# EAGLE design Video_1.0 (EAGLE 9.7.0)

## Sheet 1 of 2: BUS
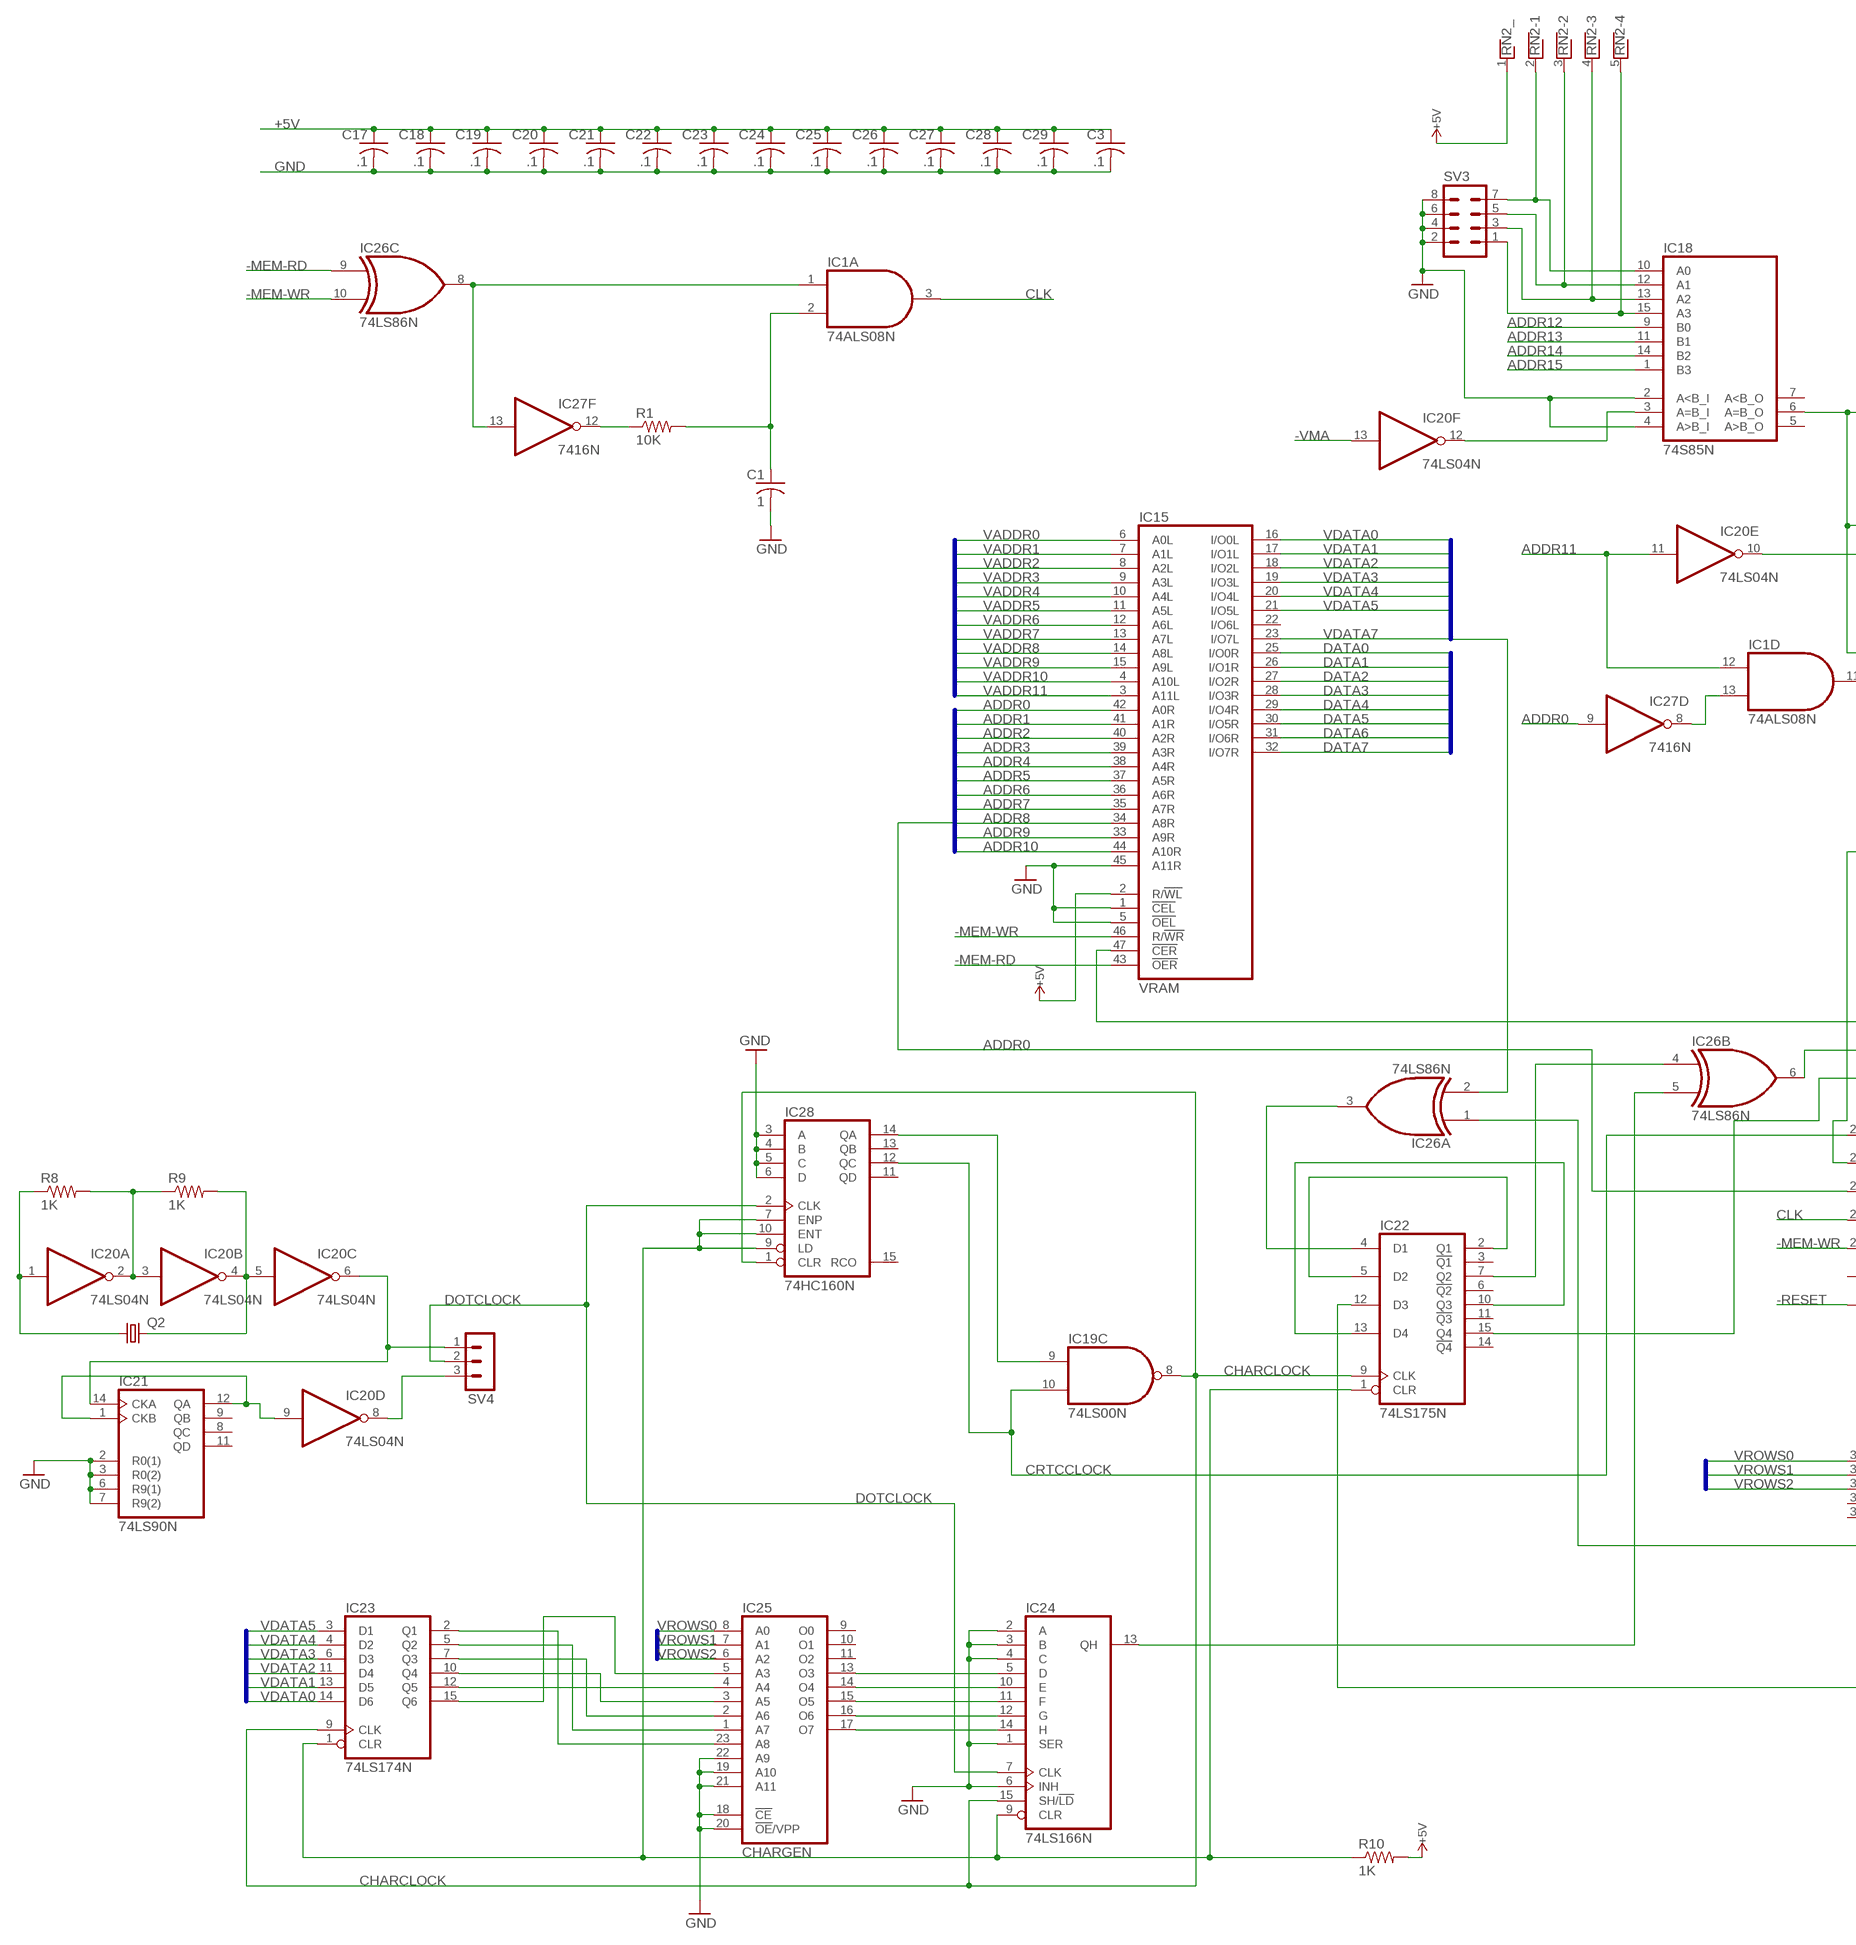
[diagram p0: schematic, sheet 1, part 1 of 2]
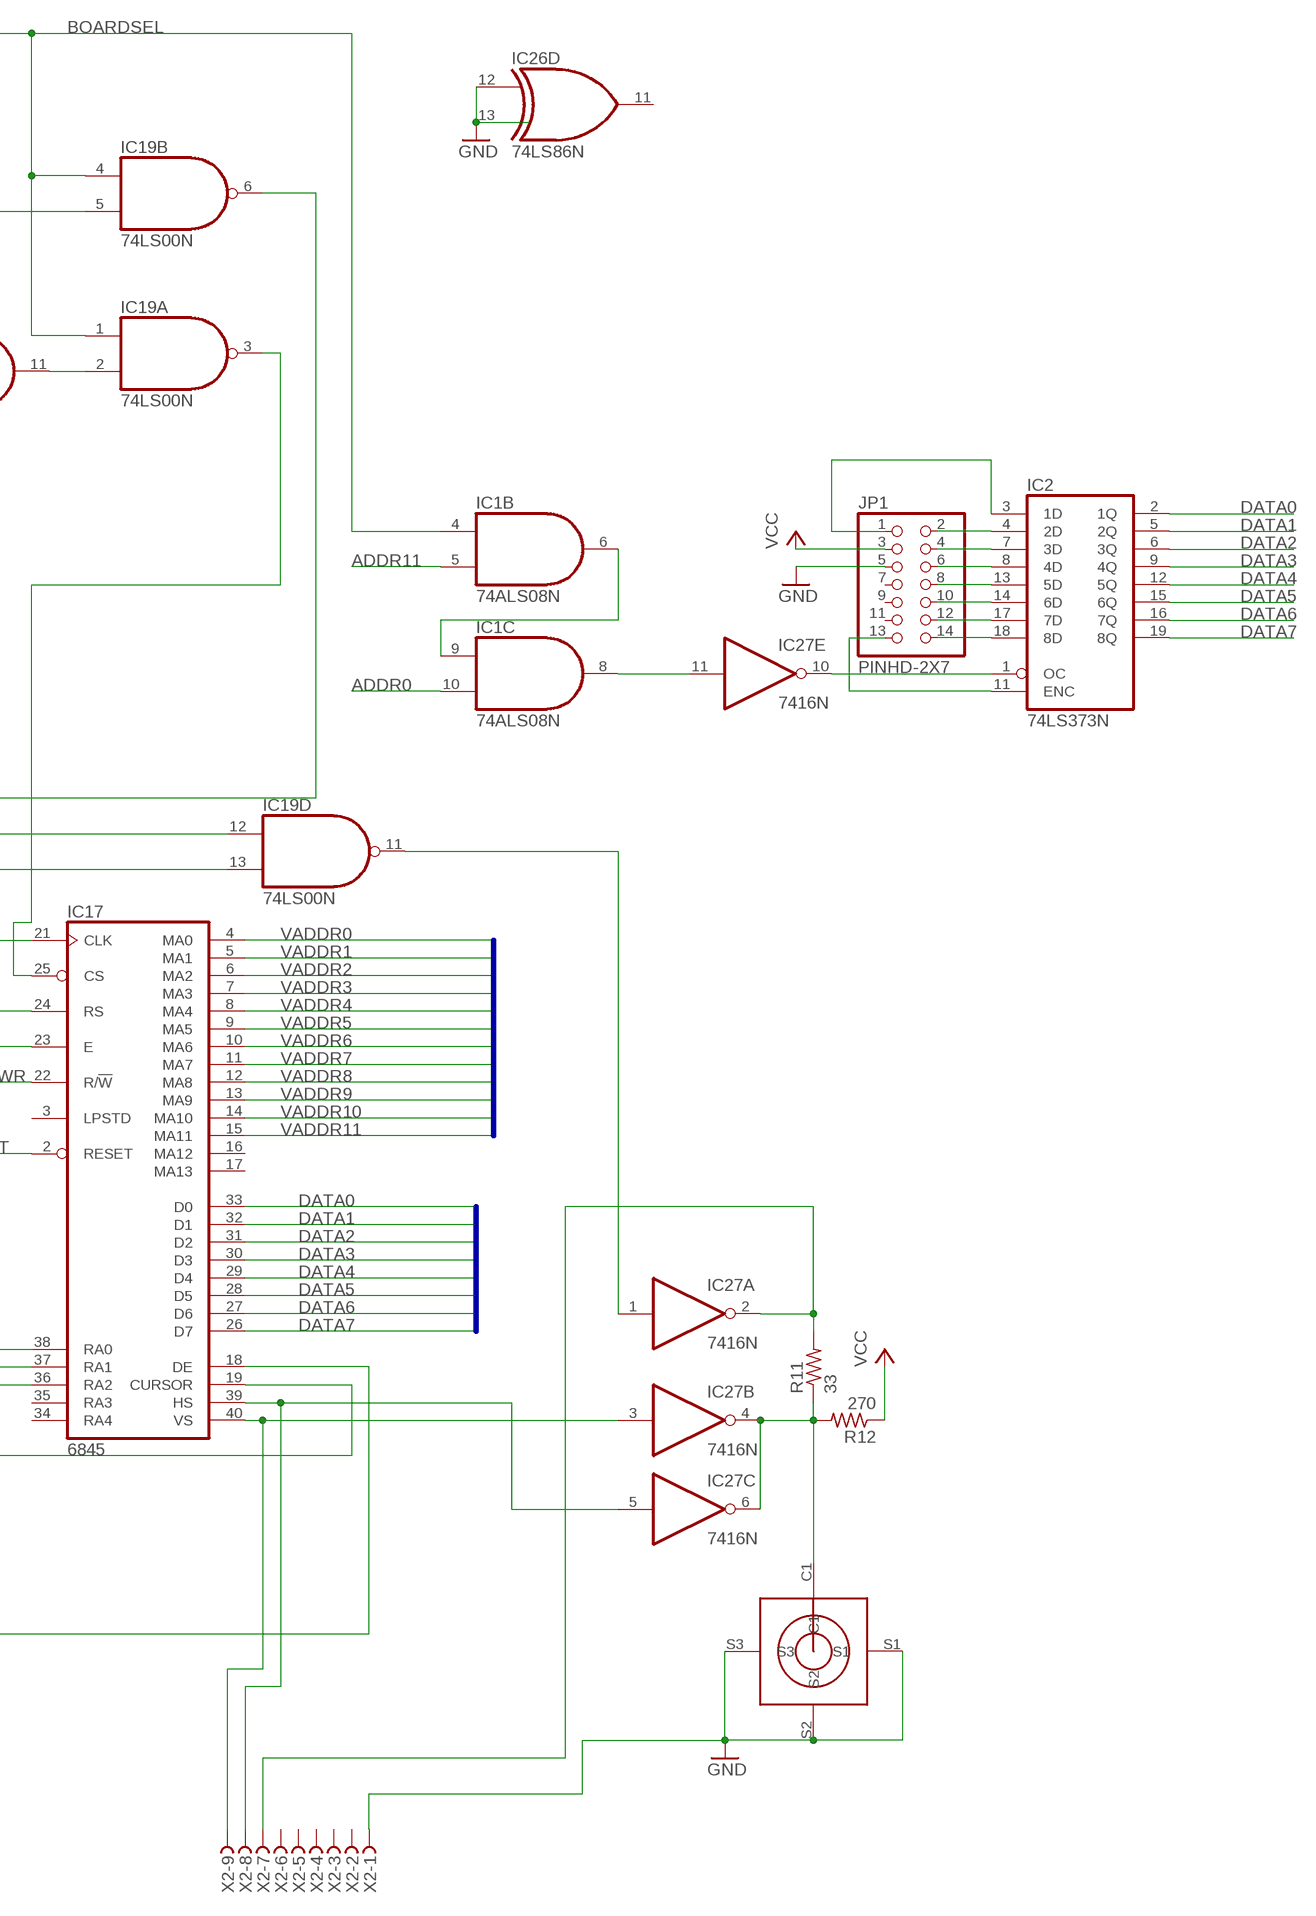
[diagram p1: schematic, sheet 1, part 2 of 2]

### Parts
C1  1  C-US025-050X050  [C025-050X050]
C3  .1  C-US025-050X050  [C025-050X050]
C17  .1  C-US025-050X050  [C025-050X050]
C18  .1  C-US025-050X050  [C025-050X050]
C19  .1  C-US025-050X050  [C025-050X050]
C20  .1  C-US025-050X050  [C025-050X050]
C21  .1  C-US025-050X050  [C025-050X050]
C22  .1  C-US025-050X050  [C025-050X050]
C23  .1  C-US025-050X050  [C025-050X050]
C24  .1  C-US025-050X050  [C025-050X050]
C25  .1  C-US025-050X050  [C025-050X050]
C26  .1  C-US025-050X050  [C025-050X050]
C27  .1  C-US025-050X050  [C025-050X050]
C28  .1  C-US025-050X050  [C025-050X050]
C29  .1  C-US025-050X050  [C025-050X050]
IC1  74ALS08N  [DIL14]
IC2  74LS373N  [DIL20]
IC15  VRAM  7134P  [DIL48]
IC17  6845  [DIL40]
IC18  74S85N  [DIL16]
IC19  74LS00N  [DIL14]
IC20  74LS04N  [DIL14]
IC21  74LS90N  [DIL14]
IC22  74LS175N  [DIL16]
IC23  74LS174N  [DIL16]
IC24  74LS166N  [DIL16]
IC25  CHARGEN  2732  [DIL24]
IC26  74LS86N  [DIL14]
IC27  7416N  [DIL14]
IC28  74HC160N  [DIL16]
JP1  PINHD-2X7  [2X07]
Q2  CRYTALHC49U-V  [HC49U-V]
R1  10K  R-US_0207/7  [0207/7]
R8  1K  R-US_0207/7  [0207/7]
R9  1K  R-US_0207/7  [0207/7]
R10  1K  R-US_0207/7  [0207/7]
R11  33  R-US_0207/7  [0207/7]
R12  270  R-US_0207/7  [0207/7]
RN2  RNX4  [RN-5]
SV3  MA04-2  [MA04-2]
SV4  MA03-1  [MA03-1]
U$3  RCA  [RCA]
X2  F09HPS  [F09HP]

### Nets
+5V [GND]: C3.1 C17.1 C18.1 C19.1 C20.1 C21.1 C22.1 C23.1 C24.1 C25.1 C26.1 C27.1 C28.1 C29.1 IC15.2(R/!WL) R10.2 R12.1 RN2.1 ; supply symbol labelled VCC ; also sheet 2
-MEM-RD: IC15.43(!OER) IC26.9(C:I0) ; also sheet 2
-MEM-WR: IC15.46(R/!WR) IC17.22(R/!W) IC26.10(C:I1) ; also sheet 2
-RESET: IC17.2(RESET) ; also sheet 2
-VMA: IC20.13(F:I) ; also sheet 2
ADDR0: IC1.10(C:I1) IC15.42(A0R) IC17.24(RS) IC27.9(D:I) ; also sheet 2
ADDR1: IC15.41(A1R) ; also sheet 2
ADDR2: IC15.40(A2R) ; also sheet 2
ADDR3: IC15.39(A3R) ; also sheet 2
ADDR4: IC15.38(A4R) ; also sheet 2
ADDR5: IC15.37(A5R) ; also sheet 2
ADDR6: IC15.36(A6R) ; also sheet 2
ADDR7: IC15.35(A7R) ; also sheet 2
ADDR8: IC15.34(A8R) ; also sheet 2
ADDR9: IC15.33(A9R) ; also sheet 2
ADDR10: IC15.44(A10R) ; also sheet 2
ADDR11: IC1.5(B:I1) IC1.12(D:I0) IC20.11(E:I) ; also sheet 2
ADDR12: IC18.9(B0) ; also sheet 2
ADDR13: IC18.11(B1) ; also sheet 2
ADDR14: IC18.14(B2) ; also sheet 2
ADDR15: IC18.1(B3) ; also sheet 2
BOARDSEL: IC1.4(B:I0) IC18.6(A=B_O) IC19.1(A:I0) IC19.4(B:I0)
CHARCLOCK: IC19.8(C:O) IC22.9(CLK) IC23.9(CLK) IC24.15(SH/!LD) IC28.1(CLR)
CLK: IC1.3(A:O) IC17.23(E)
CRTCCLOCK: IC17.21(CLK) IC19.10(C:I1) IC28.12(QC)
DATA0: IC2.2(1Q) IC15.25(I/O0R) IC17.33(D0) ; also sheet 2
DATA1: IC2.5(2Q) IC15.26(I/O1R) IC17.32(D1) ; also sheet 2
DATA2: IC2.6(3Q) IC15.27(I/O2R) IC17.31(D2) ; also sheet 2
DATA3: IC2.9(4Q) IC15.28(I/O3R) IC17.30(D3) ; also sheet 2
DATA4: IC2.12(5Q) IC15.29(I/O4R) IC17.29(D4) ; also sheet 2
DATA5: IC2.15(6Q) IC15.30(I/O5R) IC17.28(D5) ; also sheet 2
DATA6: IC2.16(7Q) IC15.31(I/O6R) IC17.27(D6) ; also sheet 2
DATA7: IC2.19(8Q) IC15.32(I/O7R) IC17.26(D7) ; also sheet 2
DOTCLOCK: IC24.7(CLK) IC28.2(CLK) SV4.2
GND: C1.2 C3.2 C17.2 C18.2 C19.2 C20.2 C21.2 C22.2 C23.2 C24.2 C25.2 C26.2 C27.2 C28.2 C29.2 IC15.1(!CEL) IC15.5(!OEL) IC15.45(A11R) IC18.2(A<B_I) IC18.4(A>B_I) IC21.2(R0(1)) IC21.3(R0(2)) IC21.6(R9(1)) IC21.7(R9(2)) IC24.1(SER) IC24.2(A) IC24.3(B) IC24.4(C) IC24.6(INH) IC25.18(!CE) IC25.19(A10) IC25.20(!OE!/VPP) IC25.21(A11) IC25.22(A9) IC26.12(D:I0) IC26.13(D:I1) IC28.3(A) IC28.4(B) IC28.5(C) IC28.6(D) JP1.5 SV3.2 SV3.4 SV3.6 SV3.8 U$3.S1 U$3.S2 U$3.S3 X2.1 ; also sheet 2
N$1: IC1.1(A:I0) IC26.8(C:O) IC27.13(F:I)
N$2: IC1.11(D:O) IC19.2(A:I1)
N$3: IC27.12(F:O) R1.1
N$4: C1.1 IC1.2(A:I1) R1.2
N$5: IC1.13(D:I1) IC27.8(D:O)
N$6: IC1.8(C:O) IC27.11(E:I)
N$7: IC2.18(8D) JP1.14
N$8: IC2.17(7D) JP1.12
N$9: IC2.14(6D) JP1.10
N$10: IC2.13(5D) JP1.8
N$12: IC2.8(4D) JP1.6
N$13: IC2.7(3D) JP1.4
N$14: IC2.4(2D) JP1.2
N$15: IC2.3(1D) JP1.1
N$16: IC2.1(OC) IC27.10(E:O)
N$17: IC1.6(B:O) IC1.9(C:I0)
N$18: IC2.11(ENC) JP1.13
N$48: IC18.10(A0) RN2.2 SV3.7
N$49: IC18.12(A1) RN2.3 SV3.5
N$50: IC18.13(A2) RN2.4 SV3.3
N$51: IC18.15(A3) RN2.5 SV3.1
N$52: IC15.47(!CER) IC19.6(B:O)
N$54: IC20.1(A:I) Q2.1 R8.1
N$55: IC20.4(B:O) IC20.5(C:I) Q2.2 R9.2
N$56: IC20.2(A:O) IC20.3(B:I) R8.2 R9.1
N$57: IC20.6(C:O) IC21.14(CKA) SV4.1
N$58: IC20.9(D:I) IC21.1(CKB) IC21.12(QA)
N$59: IC20.8(D:O) SV4.3
N$60: IC19.9(C:I0) IC28.14(QA)
N$61: IC22.2(Q1) IC22.5(D2)
N$62: IC24.5(D) IC25.13(O3)
N$63: IC24.10(E) IC25.14(O4)
N$64: IC24.11(F) IC25.15(O5)
N$65: IC24.12(G) IC25.16(O6)
N$66: IC24.14(H) IC25.17(O7)
N$67: IC23.2(Q1) IC25.23(A8)
N$68: IC23.5(Q2) IC25.1(A7)
N$69: IC23.7(Q3) IC25.2(A6)
N$70: IC23.10(Q4) IC25.3(A5)
N$71: IC23.12(Q5) IC25.4(A4)
N$72: IC23.15(Q6) IC25.5(A3)
N$73: IC22.1(CLR) IC23.1(CLR) IC24.9(CLR) IC28.7(ENP) IC28.9(LD) IC28.10(ENT) R10.1
N$74: IC17.19(CURSOR) IC26.1(A:I0)
N$75: IC22.4(D1) IC26.3(A:O)
N$76: IC22.7(Q2) IC26.4(B:I0)
N$77: IC24.13(QH) IC26.5(B:I1)
N$78: IC22.10(Q3) IC22.13(D4)
N$79: IC17.18(DE) IC22.12(D3)
N$80: IC19.12(D:I0) IC26.6(B:O)
N$81: IC19.13(D:I1) IC22.15(Q4)
N$82: IC17.40(VS) IC27.3(B:I) X2.9
N$83: IC17.39(HS) IC27.5(C:I) X2.8
N$84: IC19.11(D:O) IC27.1(A:I)
N$85: IC27.4(B:O) IC27.6(C:O) R11.1 R12.2 U$3.C1
N$86: IC27.2(A:O) R11.2 X2.7
N$87: IC19.5(B:I1) IC20.10(E:O)
N$89: IC18.3(A=B_I) IC20.12(F:O)
N$91: IC17.25(CS) IC19.3(A:O)
VADDR0: IC15.6(A0L) IC17.4(MA0)
VADDR1: IC15.7(A1L) IC17.5(MA1)
VADDR2: IC15.8(A2L) IC17.6(MA2)
VADDR3: IC15.9(A3L) IC17.7(MA3)
VADDR4: IC15.10(A4L) IC17.8(MA4)
VADDR5: IC15.11(A5L) IC17.9(MA5)
VADDR6: IC15.12(A6L) IC17.10(MA6)
VADDR7: IC15.13(A7L) IC17.11(MA7)
VADDR8: IC15.14(A8L) IC17.12(MA8)
VADDR9: IC15.15(A9L) IC17.13(MA9)
VADDR10: IC15.4(A10L) IC17.14(MA10)
VADDR11: IC15.3(A11L) IC17.15(MA11)
VCC: JP1.3 ; also sheet 2
VDATA0: IC15.16(I/O0L) IC23.14(D6)
VDATA1: IC15.17(I/O1L) IC23.13(D5)
VDATA2: IC15.18(I/O2L) IC23.11(D4)
VDATA3: IC15.19(I/O3L) IC23.6(D3)
VDATA4: IC15.20(I/O4L) IC23.4(D2)
VDATA5: IC15.21(I/O5L) IC23.3(D1)
VDATA7: IC15.23(I/O7L) IC26.2(A:I1)
VROWS0: IC17.38(RA0) IC25.8(A0)
VROWS1: IC17.37(RA1) IC25.7(A1)
VROWS2: IC17.36(RA2) IC25.6(A2)
Unconnected: IC15.22(I/O6L) IC17.3(LPSTD) IC17.16(MA12) IC17.17(MA13) IC17.34(RA4) IC17.35(RA3) IC18.5(A>B_O) IC18.7(A<B_O) IC21.8(QC) IC21.9(QB) IC21.11(QD) IC22.3(!Q1) IC22.6(!Q2) IC22.11(!Q3) IC22.14(!Q4) IC25.9(O0) IC25.10(O1) IC25.11(O2) IC26.11(D:O) IC28.11(QD) IC28.13(QB) IC28.15(RCO) JP1.7 JP1.9 JP1.11 X2.2 X2.3 X2.4 X2.5 X2.6

### Buses
VADDR[0..11]
VDATA[0..7]
CPUDATA[0..7],D0,D1,D2,D3,D4,D5,D6,D7,DATA0,DATA1,DATA2,DATA3,DATA4,DATA5,DATA6,DATA7
A0,A1,A2,A3,A4,A5,A6,A7,ADDR[0..15]
VROWS[0..4]

## Sheet 2 of 2
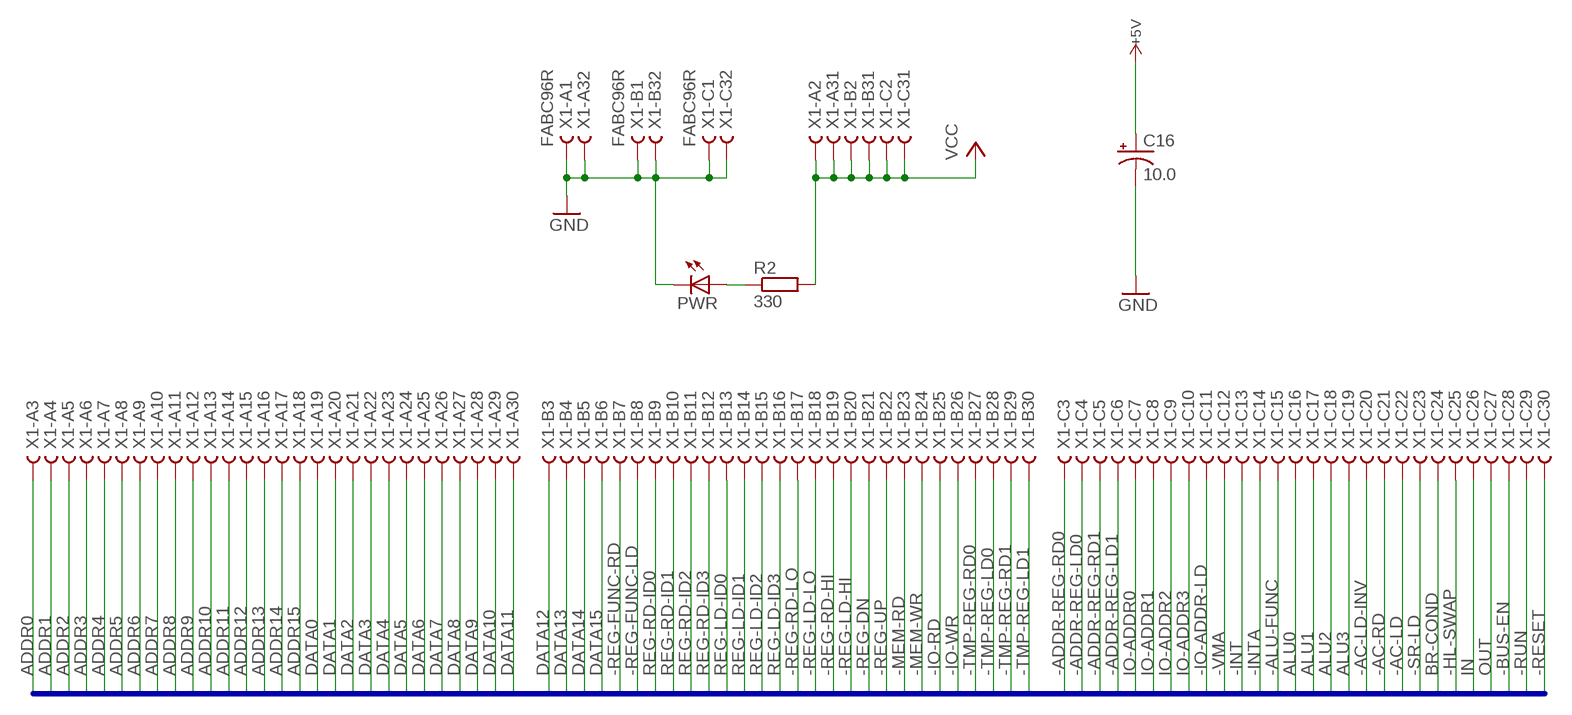
[diagram p2: schematic, sheet 2]

### Parts
C16  10.0  CPOL-USE2.5-7  [E2,5-7]
PWR  LED5MM  [LED5MM]
R2  330  R0207/10  [0207/10]
X1  FABC96R  [FABC96R]

### Nets
+5V [GND]: C16.+ ; also sheet 1
-AC-LD: X1.C22
-AC-LD-INV: X1.C20
-AC-RD: X1.C21
-ADDR-REG-LD0: X1.C4
-ADDR-REG-LD1: X1.C6
-ADDR-REG-RD0: X1.C3
-ADDR-REG-RD1: X1.C5
-ALU-FUNC: X1.C15
-BUS-EN: X1.C28
-HL-SWAP: X1.C25
-INT: X1.C13
-INTA: X1.C14
-IO-ADDR-LD: X1.C11
-IO-RD: X1.B25
-IO-WR: X1.B26
-MEM-RD: X1.B23 ; also sheet 1
-MEM-WR: X1.B24 ; also sheet 1
-REG-DN: X1.B21
-REG-FUNC-LD: X1.B8
-REG-FUNC-RD: X1.B7
-REG-LD-HI: X1.B20
-REG-LD-LO: X1.B18
-REG-RD-HI: X1.B19
-REG-RD-LO: X1.B17
-REG-UP: X1.B22
-RESET: X1.C30 ; also sheet 1
-RUN: X1.C29
-SR-LD: X1.C23
-TMP-REG-LD0: X1.B28
-TMP-REG-LD1: X1.B30
-TMP-REG-RD0: X1.B27
-TMP-REG-RD1: X1.B29
-VMA: X1.C12 ; also sheet 1
ADDR0: X1.A3 ; also sheet 1
ADDR1: X1.A4 ; also sheet 1
ADDR2: X1.A5 ; also sheet 1
ADDR3: X1.A6 ; also sheet 1
ADDR4: X1.A7 ; also sheet 1
ADDR5: X1.A8 ; also sheet 1
ADDR6: X1.A9 ; also sheet 1
ADDR7: X1.A10 ; also sheet 1
ADDR8: X1.A11 ; also sheet 1
ADDR9: X1.A12 ; also sheet 1
ADDR10: X1.A13 ; also sheet 1
ADDR11: X1.A14 ; also sheet 1
ADDR12: X1.A15 ; also sheet 1
ADDR13: X1.A16 ; also sheet 1
ADDR14: X1.A17 ; also sheet 1
ADDR15: X1.A18 ; also sheet 1
ALU0: X1.C16
ALU1: X1.C17
ALU2: X1.C18
ALU3: X1.C19
BR-COND: X1.C24
DATA0: X1.A19 ; also sheet 1
DATA1: X1.A20 ; also sheet 1
DATA2: X1.A21 ; also sheet 1
DATA3: X1.A22 ; also sheet 1
DATA4: X1.A23 ; also sheet 1
DATA5: X1.A24 ; also sheet 1
DATA6: X1.A25 ; also sheet 1
DATA7: X1.A26 ; also sheet 1
DATA8: X1.A27
DATA9: X1.A28
DATA10: X1.A29
DATA11: X1.A30
DATA12: X1.B3
DATA13: X1.B4
DATA14: X1.B5
DATA15: X1.B6
GND: C16.- PWR.K(C) X1.A1 X1.A32 X1.B1 X1.B32 X1.C1 X1.C32 ; also sheet 1
IN: X1.C26
IO-ADDR0: X1.C7
IO-ADDR1: X1.C8
IO-ADDR2: X1.C9
IO-ADDR3: X1.C10
N$11: PWR.A R2.1
OUT: X1.C27
REG-LD-ID0: X1.B13
REG-LD-ID1: X1.B14
REG-LD-ID2: X1.B15
REG-LD-ID3: X1.B16
REG-RD-ID0: X1.B9
REG-RD-ID1: X1.B10
REG-RD-ID2: X1.B11
REG-RD-ID3: X1.B12
VCC: R2.2 X1.A2 X1.A31 X1.B2 X1.B31 X1.C2 X1.C31 ; also sheet 1

### Buses
-AC-LD,-AC-LD-INV,-AC-RD,ADDR[0..15],-ADDR-REG-LD[0..1],-ADDR-REG-RD[0..1],ALU[0..3],-ALU-FUNC,BR-COND,-BUS-EN,DATA[0..15],-HL-SWAP,IN,-INT,-INTA,IO-ADDR[0..3],-IO-ADDR-LD,-IO-RD,-IO-WR,-MEM-RD,-MEM-WR,OUT,-REG-DN,-REG-FUNC-LD,-REG-FUNC-RD,-REG-LD-HI,REG-LD-ID[0..3],-REG-LD-LO,-REG-RD-HI,REG-RD-ID[0..3],-REG-RD-LO,-REG-UP,-RESET,-RUN,-SR-LD,-TMP-REG-LD[0..1],-TMP-REG-RD[0..1],-VMA

## Power pins joined to a net without a drawn wire
+5V: IC1.14(P:VCC) IC2.20(VCC)
GND: IC1.7(P:GND) IC2.10(GND) IC15.24(GND) IC17.1(GND) IC18.8(GND) IC19.7(P:GND) IC20.7(P:GND) IC21.10(GND) IC22.8(GND) IC23.8(GND) IC24.8(GND) IC25.12(GND) IC26.7(P:GND) IC27.7(P:GND) IC28.8(GND)
VCC: IC15.48(VCC) IC17.20(VCC) IC18.16(VCC) IC19.14(P:VCC) IC20.14(P:VCC) IC21.5(VCC) IC22.16(VCC) IC23.16(VCC) IC24.16(VCC) IC25.24(VCC) IC26.14(P:VCC) IC27.14(P:VCC) IC28.16(VCC)

## Library data of the parts
C1 C3 C17-C29 = rcl:C-US: CAPACITOR, American symbol
C16 = rcl:CPOL-US: POLARIZED CAPACITOR, American symbol
IC1 = 74xx-us:74*08: Quad 2-input AND gate
IC2 = 74xx-us:74*373: Octal D type transparent LATCH, edge triggered
IC15 = memory-idt:7134P: MEMORY
IC17 = micro-motorola:6845: MICROCONTROLLER/MEMORY DEVICE
IC18 = 74xx-us:74*85: 4-bit magnitude COMPARATOR
IC19 = 74xx-us:74*00: Quad 2-input NAND gate
IC20 = 74xx-us:74*04: Hex INVERTER
IC21 = 74xx-us:74*90: Decade, divide by twelve and binary COUNTER
IC22 = 74xx-us:74*175: Qadruple D type FLIP FLOP, clear
IC23 = 74xx-us:74*174: Hex D type FLIP FLOP, clear
IC24 = 74xx-us:74*166: 8-bit parallel load SHIFT REGISTER
IC25 = memory:2732: MEMORY
IC26 = 74xx-us:74*86: Quad 2-input EXCLUSIV-OR (XOR) gate
IC27 = 74xx-us:74*16: Hex INVERTER, open collector, high-voltage
IC28 = 74xx-eu:74*160: Synchronous 4-bit COUNTER
JP1 = Connector:PINHD-2X7: PIN HEADER; CATEGORY: Headers; DESCRIPTION: Header, Straight, 2x7 Position; MANUFACTURER: Generic; MPN: Generic; OPERATING_TEMPERATURE: Generic; PART_STATUS: Active; PITCH: 0.100" (2.54mm); ROHS_COMPLIANCE: Generic; SERIES: Generic; SUB-CATEGORY: Headers, Male Pins; TYPE: Board to Board or Cable, Unshrouded, Through Hole, Straight
PWR = led:LED: LED OSRAM: - CHIPLED LG R971, LG N971, LY N971, LG Q971, LY Q971, LO R971, LY R971 LH N974, LH R974 LS Q976, LO Q976, LY Q976 LO Q996 - Hyper CHIPLED LW Q18S LB Q993, LB Q99A, LB R99A - SideLED LS A670, LO A670, LY A670, LG A670, LP A670 LB A673, LV A673, LT A673, LW A673 LH A674 LY A675 LS A676, LA A676, LO A676, LY A676, LW A676 LS A679, LY A679, LG A679 - Hyper Micro SIDELED® LS Y876, LA Y876, LO Y876, LY Y876 LT Y87S - SmartLED LW L88C, LW L88S LB L89C, LB L89S, LG L890 LS L89K, LO L89K, LY L89K LS L896, LA L896, LO L896, LY L896 - TOPLED LS T670, LO T670, LY T670, LG T670, LP T670 LSG T670, LSP T670, LSY T670, LOP T670, LYG T670 LG T671, LOG T671, LSG T671 LB T673, LV T673, LT T673, LW T673 LH T674 LS T676, LA T676, LO T676, LY T676, LB T676, LH T676, LSB T676, LW T676 LB T67C, LV T67C, LT T67C, LS T67K, LO T67K, LY T67K, LW E67C LS E67B, LA E67B, LO E67B, LY E67B, LB E67C, LV E67C, LT E67C LW T67C LS T679, LY T679, LG T679 LS T770, LO T770, LY T770, LG T770, LP T770 LB T773, LV T773, LT T773, LW T773 LH T774 LS E675, LA E675, LY E675, LS T675 LS T776, LA T776, LO T776, LY T776, LB T776 LHGB T686 LT T68C, LB T68C - Hyper Mini TOPLED® LB M676 - Mini TOPLED Santana® LG M470 LS M47K, LO M47K, LY M47K Source: http://www.osram.convergy.de/
Q2 = crystal:CRYTAL: CRYSTAL
R1 R8-R12 = rcl:R-US_: RESISTOR, American symbol
R2 = eagle-ltspice:R: RESISTOR, European symbol; SPICEMODEL: NONE; SPICEPREFIX: R
RN2 = resistor-net:RNX4: RESISTOR NETWORK
SV3 = con-lstb:MA04-2: PIN HEADER
SV4 = con-lstb:MA03-1: PIN HEADER
U$3 = cdp:RCA
X1 = con-vg:FABC96R: CONNECTOR female, 96 pins, type R, rows ABC, grid 2.54 mm
X2 = con-subd:F09?S: SUB-D

## Net classes
1 GND: width 1 mm
2 5V: width 1 mm

## Board
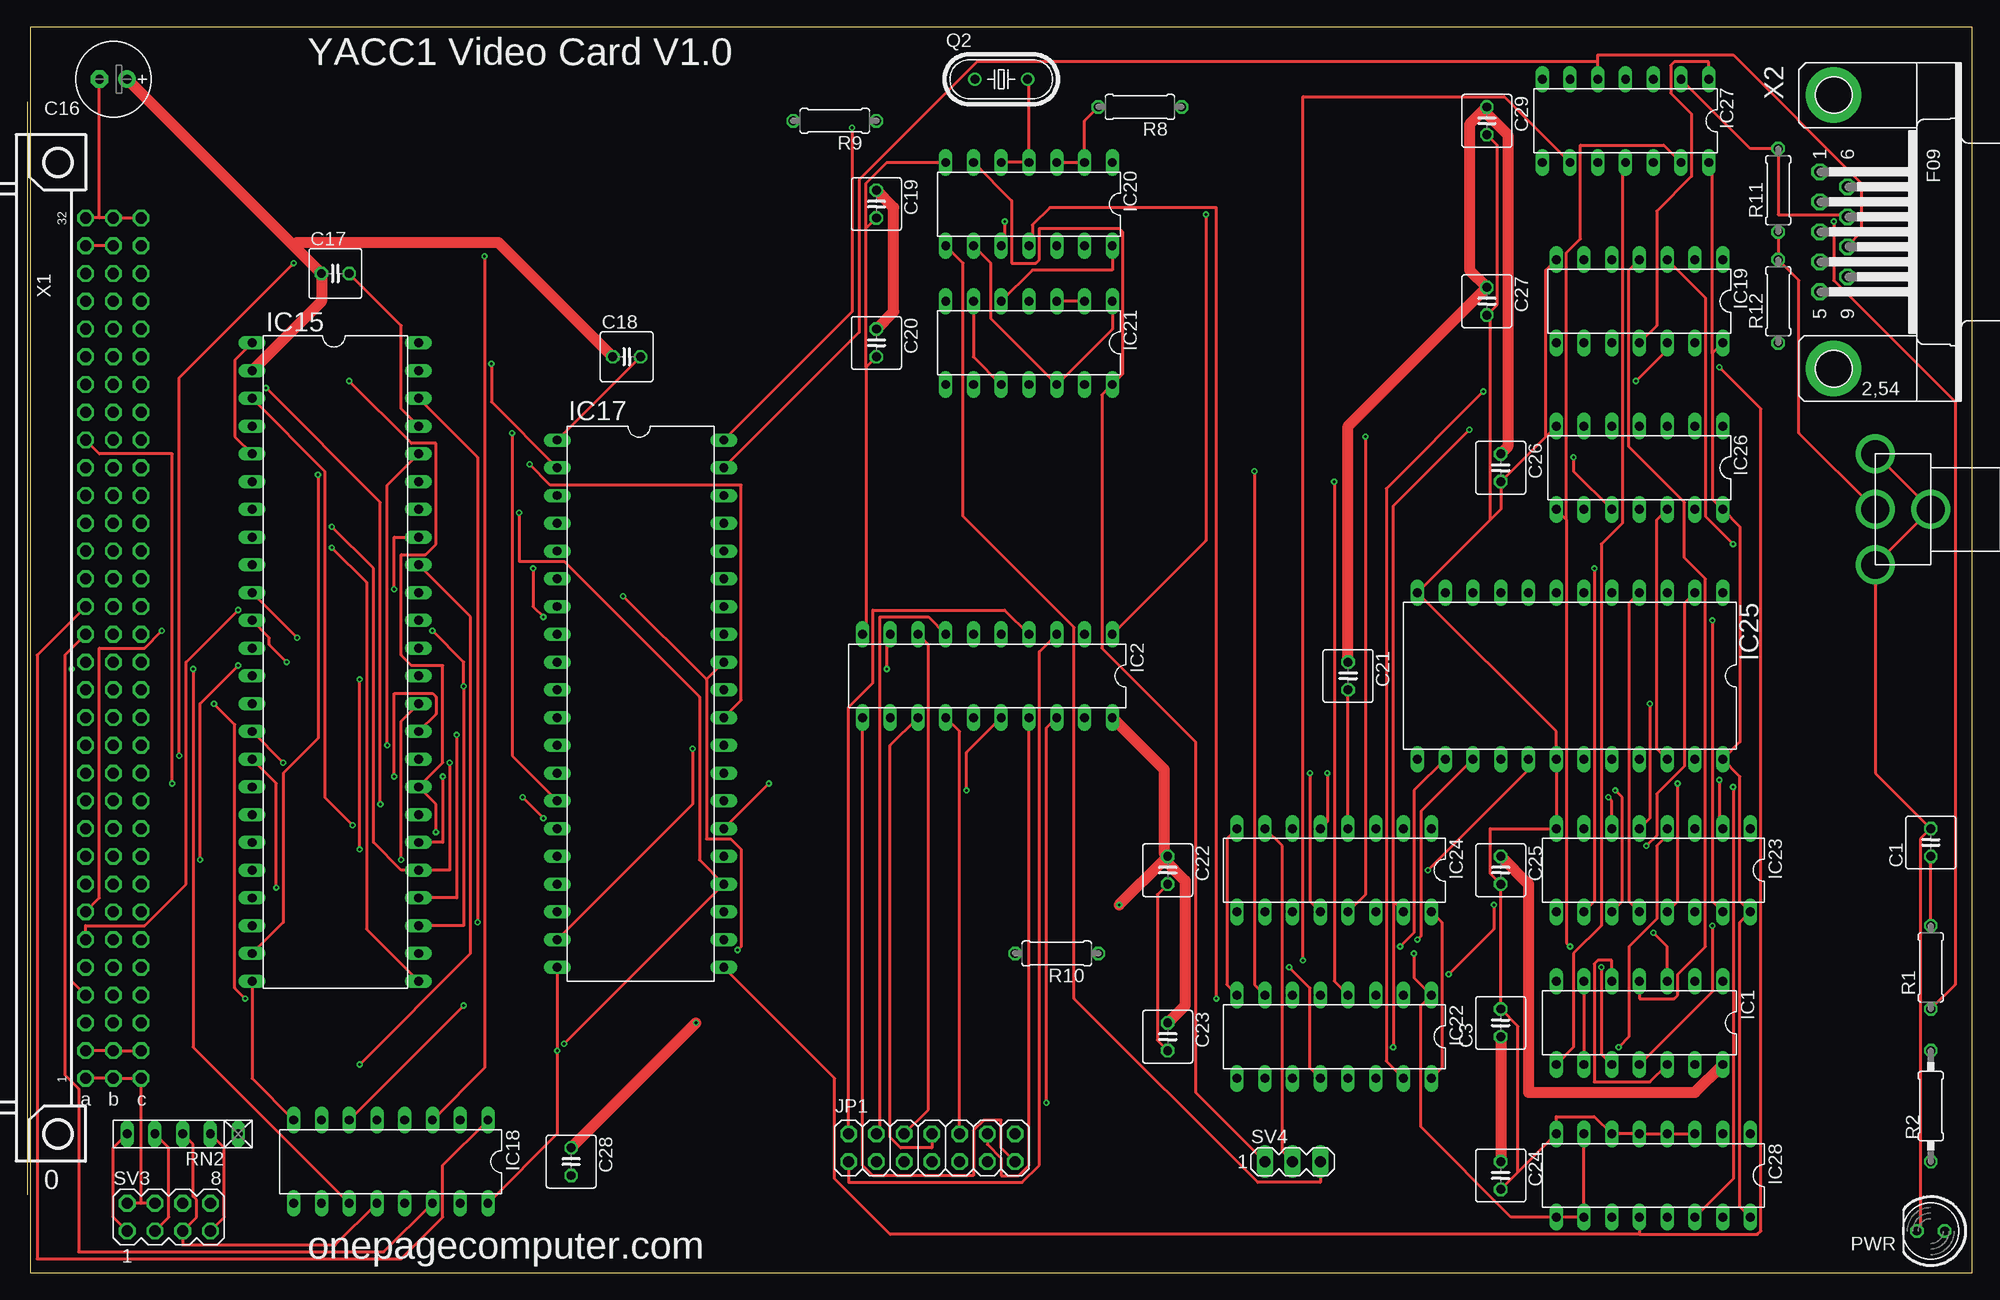
[diagram p3: board, top side]
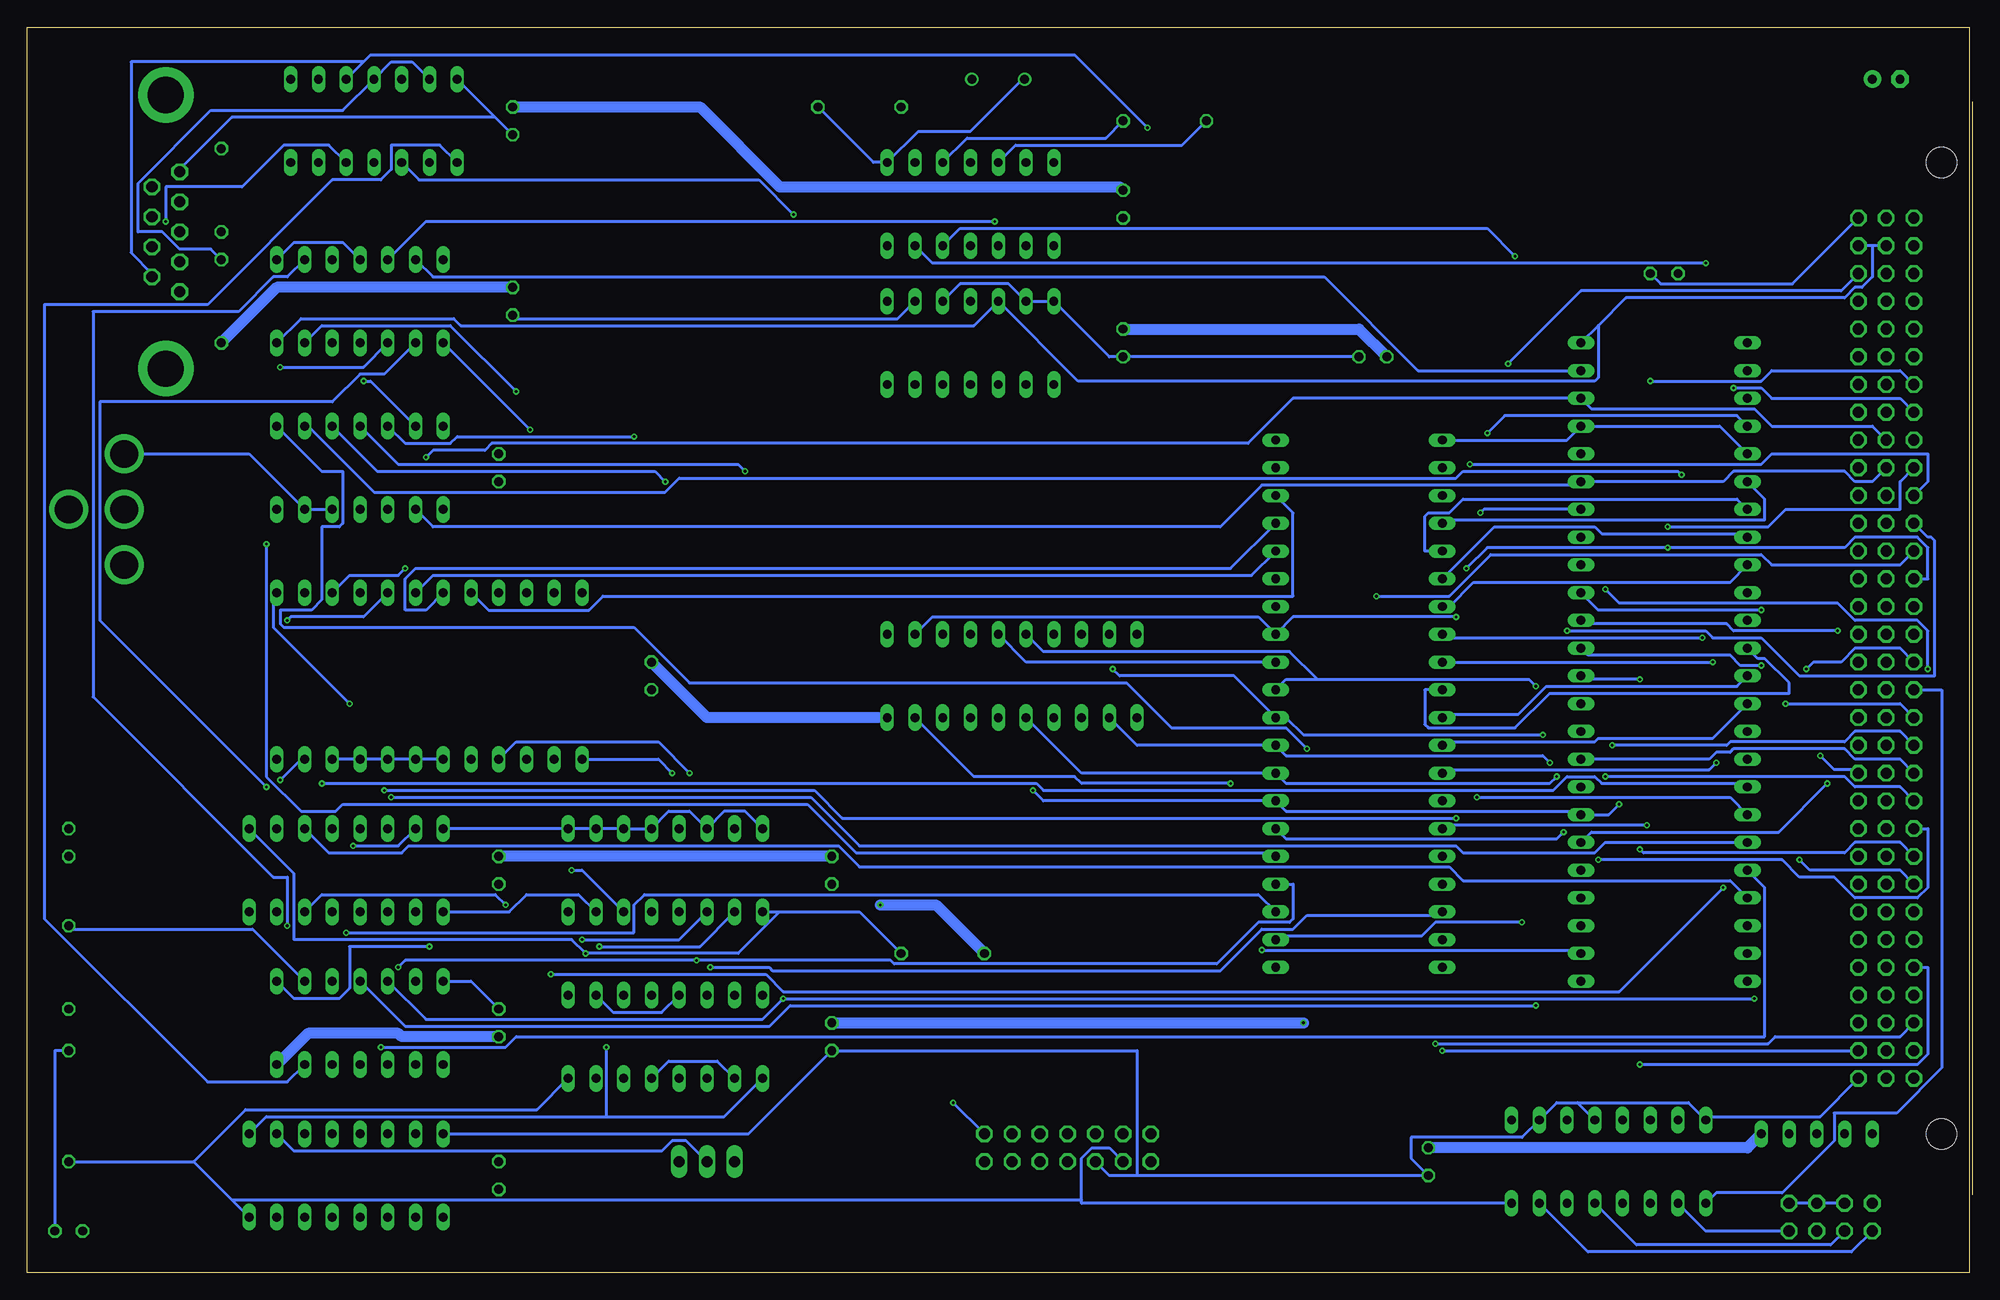
[diagram p4: board, bottom side, seen from below]

Size 177.78 x 113.97 mm. Coordinates in mm from the lower left corner, seen from the top.
Outline: 0,0 177.78,0 177.78,113.97 0,113.97 0,0
Copper layers (1*16): Top 0.035559375mm / dielectric 1.6mm / Bottom 0.035559375mm
Design rules "oshpark-2layer-auto-routing": minimum track width 10mil, minimum drill 10mil, track to track 10mil, track to pad 8mil, pad to pad 8mil, via to via 8mil, smd to smd 6mil, copper to edge 15mil, drill to drill 6mil, minimum pad ring 6mil, minimum via ring 6mil, stop-mask expansion 2.5mil, vias tented up to drill 0mil, thermal gap 10mil

### Footprints (pad centres in the part's own frame; a part is rotated, then mirrored left to right if it is on the bottom)
C025-050X050 = drill 0.813 octagon: 1 -1.27,0; 2 1.27,0
E2,5-7 = drill 0.813 pad 1.6: + -1.27,0 | drill 0.813 pad 1.6 octagon: - 1.27,0
DIL14 = drill 0.813 long: 1 -7.62,-3.81; 2 -5.08,-3.81; 3 -2.54,-3.81; 4 0,-3.81; 5 2.54,-3.81; 6 5.08,-3.81; 7 7.62,-3.81; 8 7.62,3.81; 9 5.08,3.81; 10 2.54,3.81; 11 0,3.81; 12 -2.54,3.81; 13 -5.08,3.81; 14 -7.62,3.81
DIL20 = drill 0.813 long: 1 -11.43,-3.81; 2 -8.89,-3.81; 3 -6.35,-3.81; 4 -3.81,-3.81; 5 -1.27,-3.81; 6 1.27,-3.81; 7 3.81,-3.81; 8 6.35,-3.81; 9 8.89,-3.81; 10 11.43,-3.81; 11 11.43,3.81; 12 8.89,3.81; 13 6.35,3.81; 14 3.81,3.81; 15 1.27,3.81; 16 -1.27,3.81; 17 -3.81,3.81; 18 -6.35,3.81; 19 -8.89,3.81; 20 -11.43,3.81
DIL48 = drill 0.813 long: 1 -29.21,-7.62; 2 -26.67,-7.62; 3 -24.13,-7.62; 4 -21.59,-7.62; 5 -19.05,-7.62; 6 -16.51,-7.62; 7 -13.97,-7.62; 8 -11.43,-7.62; 9 -8.89,-7.62; 10 -6.35,-7.62; 11 -3.81,-7.62; 12 -1.27,-7.62; 13 1.27,-7.62; 14 3.81,-7.62; 15 6.35,-7.62; 16 8.89,-7.62; 17 11.43,-7.62; 18 13.97,-7.62; 19 16.51,-7.62; 20 19.05,-7.62; 21 21.59,-7.62; 22 24.13,-7.62; 23 26.67,-7.62; 24 29.21,-7.62; 25 29.21,7.62; 26 26.67,7.62; 27 24.13,7.62; 28 21.59,7.62; 29 19.05,7.62; 30 16.51,7.62; 31 13.97,7.62; 32 11.43,7.62; 33 8.89,7.62; 34 6.35,7.62; 35 3.81,7.62; 36 1.27,7.62; 37 -1.27,7.62; 38 -3.81,7.62; 39 -6.35,7.62; 40 -8.89,7.62; 41 -11.43,7.62; 42 -13.97,7.62; 43 -16.51,7.62; 44 -19.05,7.62; 45 -21.59,7.62; 46 -24.13,7.62; 47 -26.67,7.62; 48 -29.21,7.62
DIL40 = drill 0.813 long: 1 -24.13,-7.62; 2 -21.59,-7.62; 3 -19.05,-7.62; 4 -16.51,-7.62; 5 -13.97,-7.62; 6 -11.43,-7.62; 7 -8.89,-7.62; 8 -6.35,-7.62; 9 -3.81,-7.62; 10 -1.27,-7.62; 11 1.27,-7.62; 12 3.81,-7.62; 13 6.35,-7.62; 14 8.89,-7.62; 15 11.43,-7.62; 16 13.97,-7.62; 17 16.51,-7.62; 18 19.05,-7.62; 19 21.59,-7.62; 20 24.13,-7.62; 21 24.13,7.62; 22 21.59,7.62; 23 19.05,7.62; 24 16.51,7.62; 25 13.97,7.62; 26 11.43,7.62; 27 8.89,7.62; 28 6.35,7.62; 29 3.81,7.62; 30 1.27,7.62; 31 -1.27,7.62; 32 -3.81,7.62; 33 -6.35,7.62; 34 -8.89,7.62; 35 -11.43,7.62; 36 -13.97,7.62; 37 -16.51,7.62; 38 -19.05,7.62; 39 -21.59,7.62; 40 -24.13,7.62
DIL16 = drill 0.813 long: 1 -8.89,-3.81; 2 -6.35,-3.81; 3 -3.81,-3.81; 4 -1.27,-3.81; 5 1.27,-3.81; 6 3.81,-3.81; 7 6.35,-3.81; 8 8.89,-3.81; 9 8.89,3.81; 10 6.35,3.81; 11 3.81,3.81; 12 1.27,3.81; 13 -1.27,3.81; 14 -3.81,3.81; 15 -6.35,3.81; 16 -8.89,3.81
DIL24 = drill 0.813 long: 1 -13.97,-7.62; 2 -11.43,-7.62; 3 -8.89,-7.62; 4 -6.35,-7.62; 5 -3.81,-7.62; 6 -1.27,-7.62; 7 1.27,-7.62; 8 3.81,-7.62; 9 6.35,-7.62; 10 8.89,-7.62; 11 11.43,-7.62; 12 13.97,-7.62; 13 13.97,7.62; 14 11.43,7.62; 15 8.89,7.62; 16 6.35,7.62; 17 3.81,7.62; 18 1.27,7.62; 19 -1.27,7.62; 20 -3.81,7.62; 21 -6.35,7.62; 22 -8.89,7.62; 23 -11.43,7.62; 24 -13.97,7.62
2X07 = drill 1.016 octagon: 1 -7.62,-1.27; 2 -7.62,1.27; 3 -5.08,-1.27; 4 -5.08,1.27; 5 -2.54,-1.27; 6 -2.54,1.27; 7 0,-1.27; 8 0,1.27; 9 2.54,-1.27; 10 2.54,1.27; 11 5.08,-1.27; 12 5.08,1.27; 13 7.62,-1.27; 14 7.62,1.27
LED5MM = drill 0.813 octagon: A -1.27,0; K 1.27,0
HC49U-V = drill 0.813: 1 -2.413,0; 2 2.413,0
0207/7 = drill 0.813 octagon: 1 -3.81,0; 2 3.81,0
0207/10 = drill 0.813 octagon: 1 -5.08,0; 2 5.08,0
RN-5 = drill 0.813 long: 1 -5.08,0; 2 -2.54,0; 3 0,0; 4 2.54,0; 5 5.08,0
MA04-2 = drill 1.016 octagon: 1 -3.81,-1.27; 2 -3.81,1.27; 3 -1.27,-1.27; 4 -1.27,1.27; 5 1.27,-1.27; 6 1.27,1.27; 7 3.81,-1.27; 8 3.81,1.27
MA03-1 = drill 1.016 long: 1 -2.54,0; 2 0,0; 3 2.54,0
RCA = drill 2.54: C1 5.08,0; S1 0,0; S2 5.08,5.08; S3 10.16,0
FABC96R = drill 1.016 octagon: A1 -2.54,39.37; A2 -2.54,36.83; A3 -2.54,34.29; A4 -2.54,31.75; A5 -2.54,29.21; A6 -2.54,26.67; A7 -2.54,24.13; A8 -2.54,21.59; A9 -2.54,19.05; A10 -2.54,16.51; A11 -2.54,13.97; A12 -2.54,11.43; A13 -2.54,8.89; A14 -2.54,6.35; A15 -2.54,3.81; A16 -2.54,1.27; A17 -2.54,-1.27; A18 -2.54,-3.81; A19 -2.54,-6.35; A20 -2.54,-8.89; A21 -2.54,-11.43; A22 -2.54,-13.97; A23 -2.54,-16.51; A24 -2.54,-19.05; A25 -2.54,-21.59; A26 -2.54,-24.13; A27 -2.54,-26.67; A28 -2.54,-29.21; A29 -2.54,-31.75; A30 -2.54,-34.29; A31 -2.54,-36.83; A32 -2.54,-39.37; B1 -5.08,39.37; B2 -5.08,36.83; B3 -5.08,34.29; B4 -5.08,31.75; B5 -5.08,29.21; B6 -5.08,26.67; B7 -5.08,24.13; B8 -5.08,21.59; B9 -5.08,19.05; B10 -5.08,16.51; B11 -5.08,13.97; B12 -5.08,11.43; B13 -5.08,8.89; B14 -5.08,6.35; B15 -5.08,3.81; B16 -5.08,1.27; B17 -5.08,-1.27; B18 -5.08,-3.81; B19 -5.08,-6.35; B20 -5.08,-8.89; B21 -5.08,-11.43; B22 -5.08,-13.97; B23 -5.08,-16.51; B24 -5.08,-19.05; B25 -5.08,-21.59; B26 -5.08,-24.13; B27 -5.08,-26.67; B28 -5.08,-29.21; B29 -5.08,-31.75; B30 -5.08,-34.29; B31 -5.08,-36.83; B32 -5.08,-39.37; C1 -7.62,39.37; C2 -7.62,36.83; C3 -7.62,34.29; C4 -7.62,31.75; C5 -7.62,29.21; C6 -7.62,26.67; C7 -7.62,24.13; C8 -7.62,21.59; C9 -7.62,19.05; C10 -7.62,16.51; C11 -7.62,13.97; C12 -7.62,11.43; C13 -7.62,8.89; C14 -7.62,6.35; C15 -7.62,3.81; C16 -7.62,1.27; C17 -7.62,-1.27; C18 -7.62,-3.81; C19 -7.62,-6.35; C20 -7.62,-8.89; C21 -7.62,-11.43; C22 -7.62,-13.97; C23 -7.62,-16.51; C24 -7.62,-19.05; C25 -7.62,-21.59; C26 -7.62,-24.13; C27 -7.62,-26.67; C28 -7.62,-29.21; C29 -7.62,-31.75; C30 -7.62,-34.29; C31 -7.62,-36.83; C32 -7.62,-39.37 | hole 2.794: 0,-44.456; 0,44.456
F09HP = drill 1.016 octagon: 1 -5.486,-1.27; 2 -2.743,-1.27; 3 0,-1.27; 4 2.743,-1.27; 5 5.486,-1.27; 6 -4.115,1.27; 7 -1.372,1.27; 8 1.372,1.27; 9 4.115,1.27 | drill 3.302 pad 5.08: G1 -12.522,0; G2 12.522,0

### Placement (x,y rotation side)
C1  173.99,39.37 90 top
C3  134.62,22.86 90 top
C16  7.62,109.22 180 top
C17  27.94,91.44 0 top
C18  54.61,83.82 0 top
C19  77.47,97.79 270 top
C20  77.47,85.09 270 top
C21  120.65,54.61 270 top
C22  104.14,36.83 270 top
C23  104.14,21.59 270 top
C24  134.62,8.89 270 top
C25  134.62,36.83 270 top
C26  134.62,73.66 270 top
C27  133.35,88.9 270 top
C28  49.53,10.16 270 top
C29  133.35,105.41 270 top
IC1  147.32,22.86 180 top
IC2  87.63,54.61 180 top
IC15  27.94,55.88 270 top
IC17  55.88,52.07 270 top
IC18  33.02,10.16 180 top
IC19  147.32,88.9 180 top
IC20  91.44,97.79 180 top
IC21  91.44,85.09 180 top
IC22  119.38,21.59 180 top
IC23  148.59,36.83 180 top
IC24  119.38,36.83 180 top
IC25  140.97,54.61 180 top
IC26  147.32,73.66 180 top
IC27  146.05,105.41 180 top
IC28  148.59,8.89 180 top
JP1  82.55,11.43 0 top
PWR  173.99,3.81 180 top
Q2  88.9,109.22 0 top
R1  173.99,27.94 90 top
R2  173.99,15.24 270 top
R8  101.6,106.68 180 top
R9  73.66,105.41 180 top
R10  93.98,29.21 180 top
R11  160.02,99.06 90 top
R12  160.02,88.9 90 top
RN2  13.97,12.7 180 top
SV3  12.7,5.08 0 top
SV4  115.57,10.16 0 top
U$3  168.91,74.93 270 top
X1  2.54,57.15 180 top
X2  165.1,95.25 270 top

### Tracks (layer width: path | path; a pad name or v marks a point on that pad's centre or on a via)
+5V  (via drill 0.25)
  Top 1: C19.1 79.06,97.47 79.06,87.95 C20.1 | IC15.2 26.67,88.9 C17.1 24.13,93.98 | 24.13,93.98 C16.+ | C18.1 42.86,94.3 24.45,94.3 24.13,93.98 | C29.1 133.03,106.36 | 133.03,106.36 131.76,105.09 131.76,91.76 C27.1 120.65,77.47 C21.1 | C26.1 135.25,75.56 135.25,104.14 133.03,106.36 | C3.1 C24.1 | 103.82,37.78 C22.1 103.82,38.42 103.82,46.04 IC2.20 | 103.82,37.78 v99.69,33.66 | C23.1 105.73,24.45 105.73,35.88 103.82,37.78 | v60.96,22.86 C28.1 | IC1.14 152.4,16.51 137.16,16.51 137.16,35.56 C25.1
  Bottom 1: C18.1 55.88,86.36 C20.1 | R12.1 154.94,90.17 C27.1 | IC1.14 152.08,21.91 143.83,21.91 143.51,21.59 C3.1 | C28.1 20.32,11.43 RN2.1 | R10.2 94.61,33.66 v99.69,33.66 | C21.1 115.57,50.8 IC2.20 | C22.1 C25.1 | C23.1 v60.96,22.86 | C19.1 77.79,99.38 108.9,99.38 116.2,106.68 C29.1
-MEM-RD
  Bottom 0.254: X1.B23 8.89,72.39 10.48,72.39 11.43,73.34 21.59,73.34 22.54,72.39 IC15.43 35.88,72.07 64.77,72.07 68.58,68.26 140.65,68.26 IC26.9
-MEM-WR  (via drill 0.25)
  Top 0.254: v40.96,32.07 40.96,74.61 IC15.46 | IC26.10 141.29,73.34 v141.29,74.61
  Bottom 0.254: IC17.22 63.18,30.8 50.16,30.8 48.9,32.07 v40.96,32.07 | v141.29,74.61 140.65,75.25 135.89,75.25 135.25,75.88 66.04,75.88 61.91,80.01 IC15.46 34.61,79.06 19.68,79.06 18.1,77.47 8.89,77.47 X1.B24
-RESET  (via drill 0.25)
  Top 0.254: IC17.2 42.23,79.69 v42.23,83.19
  Bottom 0.254: v42.23,83.19 35.56,89.85 11.75,89.85 X1.C30
-VMA  (via drill 0.25)
  Top 0.254: v24.13,92.39 13.65,81.92 v13.65,47.31
  Bottom 0.254: IC20.13 94.93,92.39 v24.13,92.39 | v13.65,47.31 12.38,46.04 10.48,46.04 X1.C12
ADDR0  (via drill 0.25)
  Top 0.254: v44.77,69.53 44.77,65.09 48.9,65.09 61.28,52.7 61.28,37.78 IC17.24 v48.9,20.95 | IC1.10 143.83,20 v143.83,27.94 | IC27.9 134.94,107.63 116.52,107.63 v116.52,28.57
  Bottom 0.254: v44.77,69.53 44.45,69.85 IC15.42 | v143.83,27.94 143.19,28.57 v116.52,28.57 98.74,28.57 98.42,28.26 68.9,28.26 65.09,32.07 62.23,32.07 61.91,32.38 61.91,35.56 IC17.24 | X1.A3 6.35,21.59 17.78,21.59 18.41,20.95 v48.9,20.95
ADDR1  (via drill 0.25)
  Top 0.254: IC15.41 33.34,67.31 v33.34,62.55 | v3.81,55.24 3.81,26.67 X1.A4
  Bottom 0.254: v33.34,62.55 32.07,61.28 12.06,61.28 10.48,59.69 4.76,59.69 3.81,58.74 v3.81,55.24
ADDR2  (via drill 0.25)
  Top 0.254: IC15.40 40.32,60.01 40.32,29.21 v30.16,19.05
  Bottom 0.254: v30.16,19.05 4.76,19.05 3.81,20 3.81,27.94 X1.A5
ADDR3  (via drill 0.25)
  Top 0.254: v19.05,60.64 14.29,55.88 14.29,35.56 10.48,31.75 5.08,31.75 X1.A6
  Bottom 0.254: IC15.39 33.97,60.64 v19.05,60.64
ADDR4  (via drill 0.25)
  Top 0.254: v12.06,58.74 10.48,57.15 6.35,57.15 6.35,34.29 X1.A7
  Bottom 0.254: IC15.38 35.24,59.37 22.23,59.37 21.59,58.74 v12.06,58.74
ADDR5  (via drill 0.25)
  Top 0.254: v19.05,55.56 15.56,52.07 v15.56,37.78
  Bottom 0.254: IC15.37 34.92,56.52 21.91,56.52 20.95,55.56 v19.05,55.56 | v15.56,37.78 14.61,36.83 6.35,36.83 X1.A8
ADDR6  (via drill 0.25)
  Top 0.254: v30.16,38.73 v30.16,54.29
  Bottom 0.254: IC15.36 35.24,54.29 v30.16,54.29 | v30.16,38.73 29.84,38.42 11.43,38.42 10.48,39.37 6.35,39.37 X1.A9
ADDR7  (via drill 0.25)
  Top 0.254: IC15.35 33.97,50.48 v33.97,37.78
  Bottom 0.254: v33.97,37.78 17.14,37.78 15.56,36.2 12.38,36.2 10.48,34.29 4.76,34.29 3.81,35.24 3.81,40.64 X1.A10
ADDR8  (via drill 0.25)
  Top 0.254: IC15.34 37.15,51.12 37.15,52.7 36.83,53.02 33.34,53.02 v33.34,45.4
  Bottom 0.254: v33.34,45.4 11.43,45.4 10.48,44.45 6.35,44.45 X1.A11
ADDR9
  Bottom 0.254: IC15.33 23.81,46.99 23.18,47.62 21.91,47.62 21.59,47.94 11.43,47.94 10.48,46.99 6.35,46.99 X1.A12
ADDR10  (via drill 0.25)
  Top 0.254: IC15.44 32.7,72.07 v32.7,48.26
  Bottom 0.254: v32.7,48.26 22.23,48.26 21.91,48.58 11.43,48.58 10.48,49.53 6.35,49.53 X1.A13
ADDR11  (via drill 0.25)
  Top 0.254: IC1.12 148.27,17.46 143.19,17.46 143.19,28.26 143.51,28.57 144.78,28.57 IC1.5 | IC20.11 91.76,94.3 91.76,95.89 93.34,97.47 108.58,97.47 v108.58,25.08 | v16.83,52.07 18.73,50.16 18.73,26.04 v19.68,25.08
  Bottom 0.254: IC1.5 141.29,23.18 110.49,23.18 v108.58,25.08 v19.68,25.08 | X1.A14 6.35,52.07 v16.83,52.07
ADDR12
  Bottom 0.254: IC18.9 23.18,7.3 17.14,7.3 12.38,12.06 12.38,14.61 6.67,14.61 2.54,18.73 2.54,53.34 X1.A15
ADDR13  (via drill 0.25)
  Top 0.254: IC18.11 14.92,20.64 v14.92,55.24
  Bottom 0.254: v14.92,55.24 14.29,55.88 11.75,55.88 10.48,57.15 6.35,57.15 X1.A16
ADDR14
  Top 0.254: IC18.14 32.38,1.91 4.45,1.91 4.45,16.83 3.17,18.1 3.17,56.52 X1.A17
ADDR15
  Top 0.254: IC18.1 37.78,9.84 37.78,5.08 33.97,1.27 0.64,1.27 0.64,56.52 X1.A18
BOARDSEL  (via drill 0.25)
  Top 0.254: v39.69,24.45 IC18.6 | IC19.4 146.37,91.76 146.37,75.56 151.45,70.48 151.45,65.41 153.35,63.5 153.35,29.84 150.81,27.3 150.81,25.4 150.5,25.08 147.32,25.08 IC1.4
  Bottom 0.254: IC19.4 148.91,94.3 153.35,94.3 IC19.1 | v39.69,24.45 107.95,24.45 109.86,22.54 143.19,22.54 IC1.4
CHARCLOCK  (via drill 0.25)
  Top 0.254: v131.76,77.15 124.78,70.17 124.78,33.97 | IC24.15 124.78,33.97 | 124.78,33.97 v124.78,20.64
  Bottom 0.254: IC22.9 113.98,14.29 124.78,14.29 | 124.78,14.29 155.89,14.29 IC28.1 | IC24.15 127.32,34.61 132.08,34.61 133.67,33.02 IC23.9 | v131.76,77.15 IC19.8 | v124.78,20.64 124.78,14.29
CLK  (via drill 0.25)
  Top 0.254: v148.59,31.11 149.86,29.84 IC1.3
  Bottom 0.254: IC17.23 65.09,34.61 121.28,34.61 122.24,33.66 122.24,31.11 v148.59,31.11
CRTCCLOCK  (via drill 0.25)
  Top 0.254: IC17.21 73.66,17.78 73.66,8.57 78.74,3.49 147.32,3.49 | IC28.12 147.32,3.49 | v154.62,82.87 158.43,79.06 158.43,3.81 158.12,3.49 147.32,3.49
  Bottom 0.254: IC19.10 147,82.87 v154.62,82.87
DATA0  (via drill 0.25)
  Top 0.254: IC15.25 30.8,31.43 30.8,63.18 v27.62,66.36 | v46.99,60.01 46.04,60.96 v46.04,64.45
  Bottom 0.254: IC2.2 94.93,60.01 65.09,60.01 IC17.33 61.91,60.01 v46.99,60.01 | X1.A19 3.81,63.5 3.81,66.36 4.76,67.31 10.48,67.31 11.43,66.36 v27.62,66.36 44.13,66.36 v46.04,64.45
DATA1  (via drill 0.25)
  Top 0.254: v64.77,29.53 65.09,29.84 65.09,38.73 64.14,39.69 61.91,39.69 61.91,54.29 | IC17.32 61.91,54.29 | 61.91,54.29 v54.29,61.91
  Bottom 0.254: IC15.26 35.88,29.53 v64.77,29.53 | IC2.5 86.36,55.88 IC17.32 | X1.A20 6.35,64.77 18.1,64.77 19.05,65.72 43.81,65.72 47.62,61.91 v54.29,61.91
DATA2  (via drill 0.25)
  Top 0.254: IC15.27 39.69,31.75 v39.69,53.66 39.69,55.88 v36.83,58.74
  Bottom 0.254: v39.69,53.66 40.32,54.29 59.69,54.29 | 59.69,54.29 62.55,54.29 IC17.31 | IC2.6 84.77,56.83 62.23,56.83 59.69,54.29 | X1.A21 3.81,67.31 3.49,67.31 3.17,66.99 3.17,54.61 15.56,54.61 19.05,58.1 23.5,58.1 24.13,58.74 v36.83,58.74
DATA3  (via drill 0.25)
  Top 0.254: IC15.28 39.05,34.29 v39.05,49.21 | IC2.9 78.42,58.1 v78.42,55.24 | v45.72,73.98 47.62,72.07 65.09,72.07 65.09,52.39 IC17.30
  Bottom 0.254: v39.05,49.21 60.96,49.21 62.55,50.8 IC17.30 67.31,54.61 77.79,54.61 v78.42,55.24 | X1.A22 3.81,72.39 3.81,74.93 18.1,74.93 19.05,73.98 v45.72,73.98
DATA4  (via drill 0.25)
  Top 0.254: v38.42,46.67 38.42,36.83 IC15.29 33.97,36.83 31.43,39.37 31.43,64.45 v27.62,68.26
  Bottom 0.254: v38.42,46.67 39.05,47.31 62.55,47.31 IC17.29 76.2,48.26 IC2.12 | X1.A23 6.35,72.39 6.35,69.85 16.83,69.85 18.41,68.26 v27.62,68.26
DATA5  (via drill 0.25)
  Top 0.254: IC15.30 37.78,39.37 v37.78,45.4 | X1.A24 6.35,74.93 13.02,74.93 v13.02,44.77
  Bottom 0.254: v37.78,45.4 38.42,44.77 62.55,44.77 IC17.28 81.28,45.72 IC2.15 | v13.02,44.77 17.46,40.32 34.61,40.32 IC15.30
DATA6  (via drill 0.25)
  Top 0.254: IC2.16 85.72,47.62 v85.72,44.13 | v21.59,80.96 32.07,70.48 v32.07,42.86
  Bottom 0.254: v85.72,44.13 84.77,43.18 IC17.27 62.55,42.23 35.88,42.23 IC15.31 33.02,41.91 v32.07,42.86 | X1.A25 6.35,80.01 18.1,80.01 19.05,80.96 v21.59,80.96
DATA7  (via drill 0.25)
  Top 0.254: v37.15,40.32 37.15,42.86 IC15.32 37.78,46.67 37.78,55.56 34.92,55.56 33.97,56.52 33.97,65.72 36.2,65.72 37.15,66.67 37.15,75.88 34.92,75.88 v29.21,81.6 | IC17.26 v67.63,44.77
  Bottom 0.254: v37.15,40.32 37.78,39.69 62.55,39.69 IC17.26 | IC2.19 91.12,45.4 81.92,45.4 81.28,44.77 v67.63,44.77 | X1.A26 6.35,82.55 18.1,82.55 19.05,81.6 v29.21,81.6
DOTCLOCK
  Top 0.254: IC24.7 114.62,39.05 114.62,11.11 SV4.2
  Bottom 0.254: IC28.2 153.35,11.11 119.7,11.11 118.75,12.06 117.47,12.06 SV4.2
GND
  Top 0.254: IC21.2 IC21.3 | IC21.10 86.36,83.82 IC21.6 | IC2.10 76.52,58.74 76.52,82.87 | C20.2 76.52,82.87 | 76.52,95.57 C19.2 | 76.52,82.87 76.52,95.57 | IC20.7 78.42,101.6 76.52,99.69 76.52,95.57 | 6.35,96.52 X1.B32 X1.C32 | 6.35,96.52 X1.A32 | 6.35,96.52 C16.- | IC15.5 18.73,76.52 18.73,83.5 IC15.1 | C18.2 IC17.1 | C17.2 33.97,86.68 33.97,79.06 IC15.45 | PWR.K 173.04,4.13 173.04,39.69 C1.2 168.91,45.72 U$3.S3 U$3.S2 U$3.S1 | X1.A1 X1.B1 X1.C1 10.16,6.35 | SV3.4 10.16,6.35 | 10.16,6.35 SV3.2 | IC18.8 20.32,17.78 IC15.24 | 133.67,68.9 134.62,69.85 C26.2 138.75,76.52 | 133.67,68.9 IC25.12 139.7,49.53 IC25.18 IC23.8 133.67,40.64 133.67,36.51 C25.2 C3.2 136.21,22.54 136.21,9.21 | 133.67,68.9 133.67,87.31 C27.2 134.3,88.58 134.3,103.19 C29.2 | 138.75,76.52 IC26.7 | IC19.7 138.75,91.76 138.75,76.52 | IC22.8 109.54,26.35 109.54,39.69 IC24.8 | IC24.4 C21.2 | C23.2 103.19,21.27 103.19,34.61 C22.2 | IC28.3 IC28.4 IC28.5 IC28.6 143.19,14.29 139.7,14.29 IC28.8 136.21,9.21 | 136.21,9.21 C24.2 | IC26.12 148.91,68.9 148.91,47.94 IC25.22
  Bottom 0.254: IC21.3 92.39,90.49 87.95,90.49 IC21.6 IC21.7 78.74,83.82 C20.2 C18.2 | IC17.1 36.83,76.2 IC15.45 22.86,77.47 IC15.5 | X1.C32 16.19,90.49 28.26,90.49 C17.2 | IC26.12 IC26.13 157.48,74.93 U$3.S1 | SV3.4 SV3.6 SV3.8 | 35.88,15.56 IC18.4 | 35.88,15.56 37.78,15.56 IC18.2 40.96,12.38 51.12,12.38 51.12,10.48 C28.2 76.2,8.89 | JP1.5 78.74,8.89 76.2,8.89 | 24.45,14.29 25.72,15.56 35.88,15.56 | X1.C1 13.65,14.29 24.45,14.29 | 24.45,14.29 IC18.8 | IC27.7 134.94,105.73 | 134.94,105.73 C29.2 | 134.94,105.73 159.07,105.73 163.83,100.97 X2.1 | IC24.8 112.08,42.23 113.98,42.23 IC24.6 117.16,42.23 119.06,42.23 IC24.4 IC24.3 IC24.2 IC24.1 IC23.8 | IC25.18 IC25.19 IC25.20 IC25.21 IC25.22 | C3.2 137.16,26.67 IC1.7 | IC28.8 111.76,12.7 C23.2 76.2,20.32 76.2,8.89 | IC21.2 98.11,87.31 133.03,87.31 C27.2
N$1  (via drill 0.25)
  Top 0.254: v140.97,29.84 140.65,30.16 140.65,68.9 | IC26.8 140.65,68.9 | IC27.13 149.54,103.19 141.92,103.19 141.92,94.61 140.65,93.34 140.65,68.9
  Bottom 0.254: IC1.1 153.35,25.08 149.22,25.08 148.27,26.04 148.27,29.84 v140.97,29.84
N$2  (via drill 0.25)
  Top 0.254: IC1.11 153.99,25.72 v153.99,31.75
  Bottom 0.254: v153.99,31.75 153.99,36.2 155.26,36.2 171.77,52.7 171.77,87.95 158.43,87.95 155.26,91.12 153.99,91.12 IC19.2
N$3  (via drill 0.25)
  Top 0.254: R1.1 176.21,26.35 176.21,79.69 165.1,90.81 v165.1,96.2
  Bottom 0.254: v165.1,96.2 165.1,99.38 158.12,99.38 154.31,103.19 150.18,103.19 IC27.12
N$4
  Top 0.254: R1.2 C1.1
  Bottom 0.254: IC1.2 157.16,31.43 173.67,31.43 R1.2
N$5
  Bottom 0.254: IC1.13 153.99,17.46 161.29,17.46 176.21,32.38 176.21,88.58 161.29,88.58 149.86,100.01 145.41,100.01 144.46,100.97 144.46,103.19 140.02,103.19 IC27.8
N$6
  Top 0.254: IC1.8 141.29,20.64 141.29,29.21 143.83,31.75 143.83,66.67 145.73,68.58 145.73,101.28 IC27.11
N$7  (via drill 0.25)
  Top 0.254: IC2.18 93.03,49.85 v93.03,15.56
  Bottom 0.254: JP1.14 v93.03,15.56
N$8
  Top 0.254: IC2.17 91.44,9.84 90.49,8.89 88.9,8.89 88.9,10.48 87.63,11.75 JP1.12
N$9
  Top 0.254: IC2.14 85.09,49.53 JP1.10
N$10
  Top 0.254: IC2.13 78.74,48.26 78.74,12.38 79.69,11.43 82.55,11.43 JP1.8
N$11
  Bottom 0.254: PWR.A 175.26,20.32 R2.1
N$12
  Top 0.254: IC2.8 82.23,57.47 82.23,14.92 JP1.6
N$13
  Top 0.254: IC2.7 82.23,60.01 77.79,60.01 77.79,13.02 JP1.4
N$14
  Top 0.254: IC2.4 89.22,60.64 77.15,60.64 77.15,53.98 74.93,51.75 JP1.2
N$15
  Top 0.254: IC2.3 92.39,56.83 92.39,9.84 90.81,8.26 74.93,8.26 JP1.1
N$16  (via drill 0.25)
  Top 0.254: IC2.1 107.63,66.99 v107.63,96.84
  Bottom 0.254: v107.63,96.84 110.81,100.01 141.92,100.01 IC27.10
N$17
  Top 0.254: IC1.6 IC1.9
N$18
  Top 0.254: IC2.11 76.2,9.84 77.15,8.89 86.36,8.89 86.36,13.02 87.31,13.97 88.9,13.97 88.9,11.43 JP1.13
N$48
  Top 0.254: RN2.2 17.78,11.43 17.78,5.08 SV3.7
  Bottom 0.254: IC18.10 24.13,3.81 SV3.7
N$49
  Top 0.254: RN2.3 14.92,11.75 14.92,6.99 15.24,6.67 15.24,5.08 SV3.5 13.97,2.54 27.94,2.54 IC18.12
N$50
  Top 0.254: RN2.4 12.7,11.43 12.7,5.08 SV3.3
  Bottom 0.254: IC18.13 30.48,2.54 12.7,2.54 SV3.3
N$51
  Top 0.254: RN2.5 7.62,11.43 7.62,5.08 SV3.1
  Bottom 0.254: IC18.15 34.92,1.91 10.79,1.91 SV3.1
N$52
  Bottom 0.254: IC15.47 50.48,82.55 59.05,91.12 140.65,91.12 IC19.6
N$54
  Bottom 0.254: Q2.1 86.68,109.22 91.44,104.46 96.2,104.46 IC20.1 100.33,101.6 R8.1
N$55
  Top 0.254: IC20.5 IC20.4 91.44,109.22 Q2.2
  Bottom 0.254: R9.2 72.07,103.19 87.31,103.19 IC20.5
N$56
  Top 0.254: IC20.3 IC20.2 96.52,105.41 R8.2
  Bottom 0.254: R9.1 79.06,103.82 91.76,103.82 IC20.3
N$57
  Top 0.254: IC20.6 89.85,98.11 89.85,92.39 92.08,92.39 92.39,92.71 92.39,95.57 99.69,95.57 100.01,95.25 100.01,82.23 IC21.14 98.11,80.33 98.11,57.15 106.68,48.58 106.68,16.51 SV4.1
N$58
  Top 0.254: IC21.1 99.06,86.36 IC21.12 87.95,87.31 87.95,92.39 IC20.9
N$59
  Top 0.254: IC20.8 85.41,92.39 85.41,69.22 95.57,59.05 95.57,25.08 112.39,8.26 118.11,8.26 SV4.3
N$60  (via drill 0.25)
  Top 0.254: IC28.14 155.89,8.57 v155.89,44.45
  Bottom 0.254: v155.89,44.45 171.13,59.69 171.13,79.69 149.86,79.69 147.32,82.23 145.1,82.23 IC19.9
N$61
  Bottom 0.254: IC22.5 119.7,23.81 124.14,23.81 IC22.2
N$62  (via drill 0.25)
  Top 0.254: IC24.5 118.75,41.27 v118.75,45.72
  Bottom 0.254: v118.75,45.72 120.02,46.99 IC25.13
N$63  (via drill 0.25)
  Top 0.254: v125.41,29.84 126.68,31.11 126.68,44.13 IC25.14
  Bottom 0.254: IC24.10 116.2,29.84 v125.41,29.84
N$64  (via drill 0.25)
  Top 0.254: v127,30.48 127.32,30.8 127.32,42.23 IC25.15
  Bottom 0.254: IC24.11 118.11,30.48 v127,30.48
N$65  (via drill 0.25)
  Top 0.254: IC24.12 117.16,33.97 v117.16,45.72
  Bottom 0.254: v117.16,45.72 120.02,48.58 133.03,48.58 IC25.16
N$66  (via drill 0.25)
  Top 0.254: v127.95,36.83 137.16,46.04 IC25.17
  Bottom 0.254: IC24.14 127,36.83 v127.95,36.83
N$67  (via drill 0.25)
  Top 0.254: IC23.2 154.62,40.96 v154.62,45.09
  Bottom 0.254: v154.62,45.09 152.72,46.99 IC25.23
N$68  (via drill 0.25)
  Top 0.254: IC23.5 148.27,41.59 v148.27,52.07
  Bottom 0.254: v148.27,52.07 155.26,59.05 155.26,62.23 IC25.1
N$69  (via drill 0.25)
  Top 0.254: v147.96,39.05 148.91,40.01 148.91,43.81 151.45,46.35 151.45,61.28 IC25.2
  Bottom 0.254: IC23.7 143.83,39.05 v147.96,39.05
N$70  (via drill 0.25)
  Top 0.254: IC23.10 143.19,33.97 v143.19,64.45
  Bottom 0.254: v143.19,64.45 143.83,63.82 148.27,63.82 IC25.3
N$71
  Top 0.254: IC23.12 146.37,33.97 146.37,61.28 IC25.4
N$72  (via drill 0.25)
  Top 0.254: IC23.15 153.99,33.97 v153.99,59.69
  Bottom 0.254: v153.99,59.69 153.67,60.01 147,60.01 IC25.5
N$73  (via drill 0.25)
  Top 0.254: IC28.7 IC28.10 IC28.9 135.57,5.08 127.32,13.34 127.32,24.45 IC22.1 126.68,26.99 v126.68,29.21
  Bottom 0.254: R10.1 101.6,33.02 108.9,33.02 | IC24.9 108.9,33.02 | IC23.1 153.35,36.51 153.35,30.48 127.95,30.48 v126.68,29.21 112.71,29.21 108.9,33.02
N$74  (via drill 0.25)
  Top 0.254: IC17.19 60.64,42.86 v60.64,47.94
  Bottom 0.254: v60.64,47.94 62.55,49.85 73.03,49.85 77.15,53.98 117.16,53.98 122.24,59.05 154.31,59.05 154.62,59.37 154.62,60.64 151.76,60.64 150.81,61.59 150.81,68.26 149.22,68.26 148.91,68.58 148.91,73.34 150.81,73.34 IC26.1
N$75  (via drill 0.25)
  Top 0.254: IC22.4 119.38,26.67 v119.38,72.39
  Bottom 0.254: v119.38,72.39 120.33,73.34 145.73,73.34 IC26.3
N$76  (via drill 0.25)
  Top 0.254: IC22.7 112.08,26.35 v112.08,73.34
  Bottom 0.254: v112.08,73.34 112.71,73.98 143.83,73.98 IC26.4
N$77  (via drill 0.25)
  Top 0.254: IC24.13 122.24,34.61 v122.24,76.52
  Bottom 0.254: v122.24,76.52 138.43,76.52 139.06,75.88 143.19,75.88 IC26.5
N$78
  Bottom 0.254: IC22.10 114.62,19.37 119.06,19.37 IC22.13
N$79  (via drill 0.25)
  Top 0.254: v115.25,27.94 117.16,26.04 117.16,18.73 IC22.12
  Bottom 0.254: IC17.18 48.58,32.7 60.64,32.7 61.91,31.43 64.77,31.43 68.58,27.62 109.54,27.62 109.86,27.94 v115.25,27.94
N$80  (via drill 0.25)
  Top 0.254: v147,81.6 149.86,84.45 IC19.12
  Bottom 0.254: IC26.6 146.37,81.6 v147,81.6
N$81  (via drill 0.25)
  Top 0.254: IC22.15 124.14,19.37 124.14,71.75 v133.03,80.64
  Bottom 0.254: v133.03,80.64 139.06,86.68 150.81,86.68 IC19.13
N$82  (via drill 0.25)
  Top 0.254: IC17.40 75.25,87.95 v75.25,104.78
  Bottom 0.254: v75.25,104.78 81.92,111.44 146.37,111.44 147,110.81 | IC27.3 147,110.81 | 147,110.81 168.28,110.81 168.28,93.34 166.37,91.44 X2.9
N$83
  Top 0.254: IC17.39 75.88,86.04 75.88,100.01 86.68,110.81 143.51,110.81 | IC27.5 143.51,110.81 | 143.51,110.81 143.51,111.44 155.89,111.44 167.64,99.69 167.64,95.25 166.37,93.98 X2.8
N$84
  Top 0.254: IC19.11 148.91,86.68 148.91,97.16 152.08,100.33 152.08,106.05 150.18,107.95 150.18,110.49 150.5,110.81 153.67,110.81 IC27.1
N$85
  Top 0.254: R11.1 R12.2 161.93,90.81 161.93,76.83 U$3.C1
  Bottom 0.254: IC27.6 142.56,110.81 144.46,110.81 IC27.4 148.91,106.36 160.97,106.36 167.64,99.69 167.64,95.25 165.42,95.25 163.83,93.66 160.97,93.66 R12.2
N$86
  Top 0.254: IC27.2 157.48,102.87 R11.2 160.02,96.84 166.37,96.84 X2.7
N$87  (via drill 0.25)
  Top 0.254: IC20.10 89.22,94.3 v89.22,96.2
  Bottom 0.254: v89.22,96.2 141.29,96.2 IC19.5
N$89  (via drill 0.25)
  Top 0.254: IC18.3 41.59,18.73 v41.59,93.03
  Bottom 0.254: v41.59,93.03 44.13,95.57 92.39,95.57 IC20.12
N$91  (via drill 0.25)
  Top 0.254: v155.89,66.67 153.35,69.22 153.35,89.22 IC19.3
  Bottom 0.254: IC17.25 63.82,38.42 101.92,38.42 106.36,42.86 148.91,42.86 149.54,42.23 152.72,42.23 155.89,45.4 v155.89,66.67
VADDR0
  Bottom 0.254: IC15.6 18.73,70.8 18.73,68.9 47.94,68.9 IC17.4
VADDR1
  Bottom 0.254: IC15.7 21.27,70.8 46.35,70.8 47.62,69.53 49.53,69.53 49.85,69.22 49.85,66.04 IC17.5
VADDR2
  Bottom 0.254: IC15.8 20.64,67.63 33.66,67.63 34.29,68.26 43.5,68.26 IC17.6
VADDR3
  Bottom 0.254: IC15.9 21.91,63.18 45.4,63.18 47.62,60.96 IC17.7
VADDR4  (via drill 0.25)
  Top 0.254: v24.45,58.1 IC15.10
  Bottom 0.254: v24.45,58.1 47.94,58.1 IC17.8
VADDR5  (via drill 0.25)
  Top 0.254: IC15.11 21.91,58.1 21.91,57.47 v23.5,55.88
  Bottom 0.254: IC17.9 v23.5,55.88
VADDR6
  Bottom 0.254: IC15.12 19.37,56.2 18.73,56.2 16.51,53.98 16.51,53.02 38.42,53.02 41.59,49.85 49.53,49.85 49.85,50.16 49.85,53.34 IC17.10
VADDR7
  Bottom 0.254: IC15.13 21.27,53.66 38.73,53.66 41.27,51.12 47.94,51.12 IC17.11
VADDR8
  Bottom 0.254: IC15.14 23.5,48.9 33.97,48.9 34.29,48.58 47.94,48.58 IC17.12
VADDR9  (via drill 0.25)
  Top 0.254: v23.18,46.67 IC15.15
  Bottom 0.254: v23.18,46.67 23.81,46.04 47.94,46.04 IC17.13
VADDR10  (via drill 0.25)
  Top 0.254: IC17.14 44.13,47.31 v44.13,76.83
  Bottom 0.254: v44.13,76.83 42.55,78.42 21.27,78.42 IC15.4
VADDR11  (via drill 0.25)
  Top 0.254: v29.53,40.96 26.99,43.5 26.99,73.34 IC15.3
  Bottom 0.254: IC17.15 47.94,40.96 v29.53,40.96
VCC  (via drill 0.25)
  Top 0.254: IC21.5 91.76,91.76 99.06,91.76 IC20.14 | X1.B31 X1.A31 | X1.A2 X1.B2 X1.C2 | IC18.16 48.26,12.7 v48.26,20.32 IC17.20 | 153.99,84.14 153.99,70.8 IC26.14 156.53,68.26 156.53,48.58 IC25.24 156.53,45.4 156.53,33.97 IC23.16 156.53,32.07 156.53,6.03 IC28.16 | IC19.14 153.99,84.14 | IC27.14 153.99,101.28 153.99,84.14 | IC22.16 129.22,18.73 129.22,32.07 IC24.16
  Bottom 0.254: 33.97,86.68 31.43,89.22 11.43,89.22 10.48,90.17 9.84,90.17 8.89,91.12 8.89,93.98 | 33.97,86.68 IC15.48 | X1.B31 8.89,93.98 | 8.89,93.98 X1.C31 | 33.97,86.68 33.97,81.92 34.29,81.6 81.6,81.6 IC21.5 91.12,86.68 138.11,86.68 138.75,87.31 152.72,87.31 IC19.14 | JP1.3 78.74,11.43 80.33,11.43 81.28,10.48 81.28,6.67 | 81.28,6.67 81.28,6.35 IC18.16 | v48.26,20.32 X1.C2 | 162.56,10.16 159.07,6.67 | 159.07,6.67 IC28.16 | R2.2 162.56,10.16 | IC22.16 131.13,14.92 157.8,14.92 162.56,10.16 | 159.07,6.67 81.28,6.67
VDATA0  (via drill 0.25)
  Top 0.254: IC15.16 22.54,44.77 v22.54,35.24 | v129.86,27.3 133.99,31.43 v133.99,33.66
  Bottom 0.254: v22.54,35.24 32.07,25.72 108.58,25.72 110.17,27.3 v129.86,27.3 | v133.99,33.66 134.94,34.61 150.81,34.61 IC23.14
VDATA1  (via drill 0.25)
  Top 0.254: v150.81,44.77 150.81,33.97 IC23.13
  Bottom 0.254: IC15.17 20.64,44.77 33.66,44.77 34.29,45.4 36.83,45.4 38.1,44.13 84.77,44.13 85.41,44.77 v150.81,44.77
VDATA2  (via drill 0.25)
  Top 0.254: v46.99,41.59 v45.09,43.5 | v145.1,44.13 145.73,43.5 145.73,33.97 IC23.11
  Bottom 0.254: IC15.18 21.91,43.5 v45.09,43.5 | v46.99,41.59 103.19,41.59 105.73,44.13 v145.1,44.13
VDATA3  (via drill 0.25)
  Top 0.254: v144.46,43.5 144.78,43.18 IC23.6
  Bottom 0.254: IC15.19 33.34,39.37 34.29,38.42 46.35,38.42 46.99,39.05 101.6,39.05 106.05,43.5 v144.46,43.5
VDATA4  (via drill 0.25)
  Top 0.254: v145.41,20.64 146.37,21.59 146.37,29.84 148.91,32.38 148.91,39.05 149.86,40.01 IC23.4
  Bottom 0.254: IC15.20 18.73,35.24 18.73,21.59 133.03,21.59 133.99,20.64 v145.41,20.64
VDATA5
  Bottom 0.254: IC15.21 21.91,35.88 46.35,35.88 47.62,37.15 101.6,37.15 103.5,39.05 142.88,39.05 143.51,38.42 150.18,38.42 IC23.3
VDATA7  (via drill 0.25)
  Top 0.254: IC15.23 23.18,32.07 23.18,45.72 26.35,48.9 v26.35,73.03
  Bottom 0.254: v26.35,73.03 26.67,73.34 46.35,73.34 46.99,72.71 118.11,72.71 119.38,71.44 146.05,71.44 152.08,77.47 IC26.2
VROWS0
  Bottom 0.254: IC17.38 61.91,69.53 61.91,61.91 125.09,61.91 126.36,60.64 135.57,60.64 IC25.8
VROWS1
  Bottom 0.254: IC17.37 67.63,64.45 142.24,64.45 143.19,63.5 143.19,60.64 141.29,60.64 IC25.7
VROWS2
  Bottom 0.254: IC17.36 65.72,63.82 140.65,63.82 IC25.6

### Text on the board
tNames: YACC1 Video Card V1.0 | 0 | onepagecomputer.com